# Altium project LPCB218__RLOOP__COMMAND_NODE.PrjPCB (part 1 of 2)
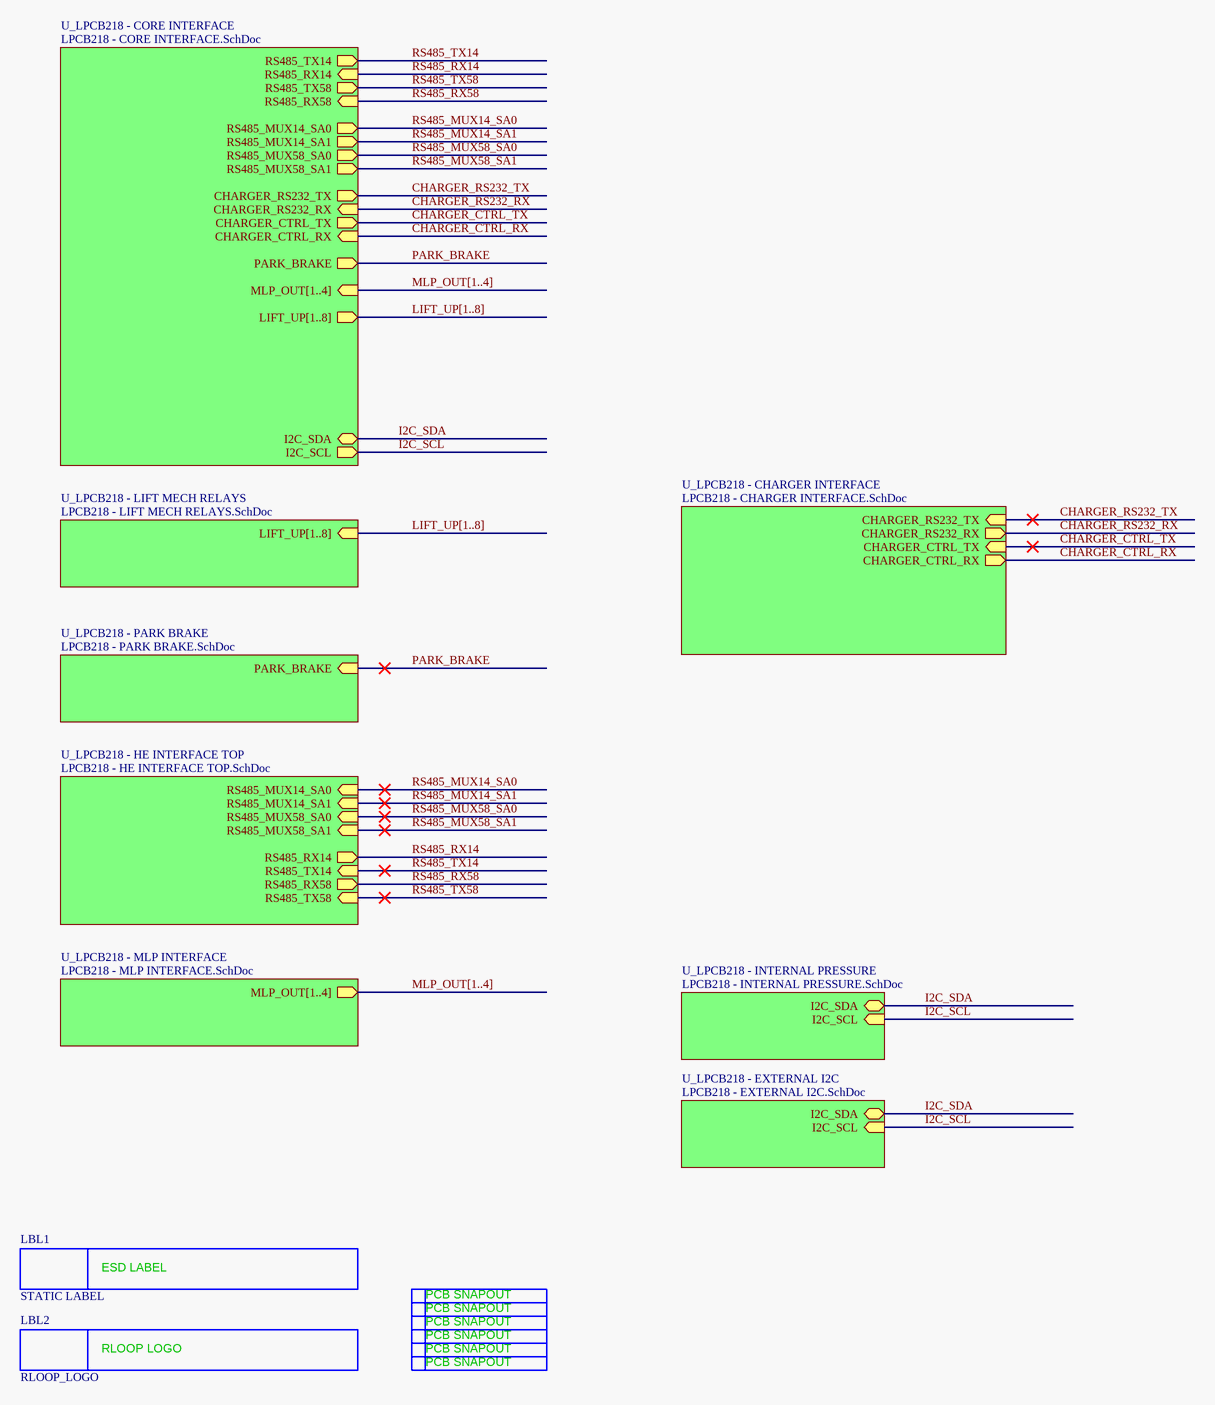
[diagram p0: LPCB218 - OVERVIEW.SchDoc]
14 sheets, 185 parts. Net scope: hierarchical (ports join the sheet entries above them; power ports are global).
Board files: LPCB218R0.PcbDoc, LPCB218R0__ASCII.PcbDoc
Sheets:
  LPCB218 - OVERVIEW.SchDoc
    U_LPCB218 - CHARGER INTERFACE = LPCB218 - CHARGER INTERFACE.SchDoc
    U_LPCB218 - LIFT MECH RELAYS = LPCB218 - LIFT MECH RELAYS.SchDoc
      L1 = LPCB218 - LIFT MECH RELAY.SchDoc
      L2 = LPCB218 - LIFT MECH RELAY.SchDoc
      L3 = LPCB218 - LIFT MECH RELAY.SchDoc
      L4 = LPCB218 - LIFT MECH RELAY.SchDoc
      L5 = LPCB218 - LIFT MECH RELAY.SchDoc
      L6 = LPCB218 - LIFT MECH RELAY.SchDoc
      L7 = LPCB218 - LIFT MECH RELAY.SchDoc
      L8 = LPCB218 - LIFT MECH RELAY.SchDoc
    U_LPCB218 - HE INTERFACE TOP = LPCB218 - HE INTERFACE TOP.SchDoc
      U_LPCB218 - RS485 MUX CONTROL = LPCB218 - RS485 MUX CONTROL.SchDoc
      U_LPCB218 - HEC1-4 = LPCB218 - HEC1-4.SchDoc
      U_LPCB218 - HEC5-8 = LPCB218 - HEC5-8.SchDoc
    U_LPCB218 - PARK BRAKE = LPCB218 - PARK BRAKE.SchDoc
    U_LPCB218 - MLP INTERFACE = LPCB218 - MLP INTERFACE.SchDoc
      M1 = LPCB218 - MLP CHANNEL.SchDoc
      M2 = LPCB218 - MLP CHANNEL.SchDoc
      M3 = LPCB218 - MLP CHANNEL.SchDoc
      M4 = LPCB218 - MLP CHANNEL.SchDoc
    U_LPCB218 - CORE INTERFACE = LPCB218 - CORE INTERFACE.SchDoc
    U_LPCB218 - INTERNAL PRESSURE = LPCB218 - INTERNAL PRESSURE.SchDoc
    U_LPCB218 - EXTERNAL I2C = LPCB218 - EXTERNAL I2C.SchDoc

## Sheet LPCB218 - OVERVIEW.SchDoc
size A3; Address1: Factory 10; Address2: 9-13 Dingley Avenue, Dandeong, VICTORIA 3175, AUSTRALIA; DocumentNumber: 1; Revision: 1; SheetNumber: 1; SheetTotal: 14; Lockie__PCB_SUB_ASSEMBLY: Top Overview; Lockie__PCB_ASSEMBLY: Command Node; Lockie__LDL: LPCB218; Lockie__PCB_DESCRIPTION: Command Node

### Parts
LBL1  STATIC LABEL  [STATIC_LABEL]  (no BOM)
LBL2  RLOOP_LOGO  [RLOOP_LOGO]  (no BOM)
SN1  PCB_SNAPOUT  [SNAPOUT_NEW]  (value not drawn)  (no BOM)
SN2  PCB_SNAPOUT  [SNAPOUT_NEW]  (value not drawn)  (no BOM)
SN3  PCB_SNAPOUT  [SNAPOUT_NEW]  (value not drawn)  (no BOM)
SN4  PCB_SNAPOUT  [SNAPOUT_NEW]  (value not drawn)  (no BOM)
SN5  PCB_SNAPOUT  [SNAPOUT_NEW]  (value not drawn)  (no BOM)
SN6  PCB_SNAPOUT  [SNAPOUT_NEW]  (value not drawn)  (no BOM)

### Sub-sheets
U_LPCB218 - CHARGER INTERFACE = LPCB218 - CHARGER INTERFACE.SchDoc: CHARGER_RS232_TX (in), CHARGER_CTRL_TX (in), CHARGER_RS232_RX (out), CHARGER_CTRL_RX (out)
U_LPCB218 - CORE INTERFACE = LPCB218 - CORE INTERFACE.SchDoc: RS485_RX14 (in), RS485_TX14 (out), PARK_BRAKE (out), CHARGER_RS232_RX (in), CHARGER_RS232_TX (out), RS485_RX58 (in), RS485_MUX14_SA0 (out), RS485_MUX14_SA1 (out), RS485_MUX58_SA0 (out), RS485_MUX58_SA1 (out), CHARGER_CTRL_TX (out), CHARGER_CTRL_RX (in), MLP_OUT[1..4] (in), LIFT_UP[1..8] (out), RS485_TX58 (out), I2C_SDA (bidir), I2C_SCL (out)
U_LPCB218 - EXTERNAL I2C = LPCB218 - EXTERNAL I2C.SchDoc: I2C_SCL (in), I2C_SDA (bidir)
U_LPCB218 - HE INTERFACE TOP = LPCB218 - HE INTERFACE TOP.SchDoc: RS485_MUX14_SA0 (in), RS485_MUX14_SA1 (in), RS485_MUX58_SA0 (in), RS485_MUX58_SA1 (in), RS485_RX14 (out), RS485_TX14 (in), RS485_RX58 (out), RS485_TX58 (in)
U_LPCB218 - INTERNAL PRESSURE = LPCB218 - INTERNAL PRESSURE.SchDoc: I2C_SDA (bidir), I2C_SCL (in)
U_LPCB218 - LIFT MECH RELAYS = LPCB218 - LIFT MECH RELAYS.SchDoc: LIFT_UP[1..8] (in)
U_LPCB218 - MLP INTERFACE = LPCB218 - MLP INTERFACE.SchDoc: MLP_OUT[1..4] (out)
U_LPCB218 - PARK BRAKE = LPCB218 - PARK BRAKE.SchDoc: PARK_BRAKE (in)

### Nets
CHARGER_CTRL_RX: sheet U_LPCB218 - CHARGER INTERFACE/CHARGER_CTRL_RX, sheet U_LPCB218 - CORE INTERFACE/CHARGER_CTRL_RX
CHARGER_CTRL_TX: sheet U_LPCB218 - CHARGER INTERFACE/CHARGER_CTRL_TX, sheet U_LPCB218 - CORE INTERFACE/CHARGER_CTRL_TX
CHARGER_RS232_RX: sheet U_LPCB218 - CHARGER INTERFACE/CHARGER_RS232_RX, sheet U_LPCB218 - CORE INTERFACE/CHARGER_RS232_RX
CHARGER_RS232_TX: sheet U_LPCB218 - CHARGER INTERFACE/CHARGER_RS232_TX, sheet U_LPCB218 - CORE INTERFACE/CHARGER_RS232_TX
I2C_SCL: sheet U_LPCB218 - CORE INTERFACE/I2C_SCL, sheet U_LPCB218 - INTERNAL PRESSURE/I2C_SCL, sheet U_LPCB218 - EXTERNAL I2C/I2C_SCL
I2C_SDA: sheet U_LPCB218 - CORE INTERFACE/I2C_SDA, sheet U_LPCB218 - INTERNAL PRESSURE/I2C_SDA, sheet U_LPCB218 - EXTERNAL I2C/I2C_SDA
PARK_BRAKE: sheet U_LPCB218 - PARK BRAKE/PARK_BRAKE, sheet U_LPCB218 - CORE INTERFACE/PARK_BRAKE
RS485_MUX14_SA0: sheet U_LPCB218 - HE INTERFACE TOP/RS485_MUX14_SA0, sheet U_LPCB218 - CORE INTERFACE/RS485_MUX14_SA0
RS485_MUX14_SA1: sheet U_LPCB218 - HE INTERFACE TOP/RS485_MUX14_SA1, sheet U_LPCB218 - CORE INTERFACE/RS485_MUX14_SA1
RS485_MUX58_SA0: sheet U_LPCB218 - HE INTERFACE TOP/RS485_MUX58_SA0, sheet U_LPCB218 - CORE INTERFACE/RS485_MUX58_SA0
RS485_MUX58_SA1: sheet U_LPCB218 - HE INTERFACE TOP/RS485_MUX58_SA1, sheet U_LPCB218 - CORE INTERFACE/RS485_MUX58_SA1
RS485_RX14: sheet U_LPCB218 - HE INTERFACE TOP/RS485_RX14, sheet U_LPCB218 - CORE INTERFACE/RS485_RX14
RS485_RX58: sheet U_LPCB218 - HE INTERFACE TOP/RS485_RX58, sheet U_LPCB218 - CORE INTERFACE/RS485_RX58
RS485_TX14: sheet U_LPCB218 - HE INTERFACE TOP/RS485_TX14, sheet U_LPCB218 - CORE INTERFACE/RS485_TX14
RS485_TX58: sheet U_LPCB218 - HE INTERFACE TOP/RS485_TX58, sheet U_LPCB218 - CORE INTERFACE/RS485_TX58

### Buses and harness runs
bus LIFT_UP[1..8] = sheet U_LPCB218 - CORE INTERFACE/LIFT_UP[1..8]
bus LIFT_UP[1..8] = sheet U_LPCB218 - LIFT MECH RELAYS/LIFT_UP[1..8]
bus MLP_OUT[1..4] = sheet U_LPCB218 - CORE INTERFACE/MLP_OUT[1..4]
bus MLP_OUT[1..4] = sheet U_LPCB218 - MLP INTERFACE/MLP_OUT[1..4]

### Notes on the sheet
- PCB COMPONENT DESCRIPTION
- LDL NUMBER
- Assembly Details
- Size
- Drawing File Name
- Revision
- http://rloop.org
- Scale
- A3
- Sheet Details
- N.T.S
- Sheet:
- Of:
- (in symbol PCB_SNAPOUT) PCB SNAPOUT
- (in symbol RLOOP_LOGO) RLOOP LOGO
- (in symbol STATIC LABEL) ESD LABEL

### Library data of the parts
LBL1 = STATIC LABEL: FMEDA__CHANNEL: DIAG; FMEDA__FUNCTION_IN_SYSTEM: *
LBL2 = RLOOP_LOGO: FMEDA__CHANNEL: DIAG; FMEDA__FUNCTION_IN_SYSTEM: *
SN1-SN6 = PCB_SNAPOUT: FMEDA__CHANNEL: DIAG; FMEDA__FUNCTION_IN_SYSTEM: *

## Sheet LPCB218 - CHARGER INTERFACE.SchDoc
size A3; Address1: Factory 10; Address2: 9-13 Dingley Avenue, Dandeong, VICTORIA 3175, AUSTRALIA; DocumentNumber: 2; Revision: 1; SheetNumber: 2; SheetTotal: 14; Lockie__PCB_SUB_ASSEMBLY: Charger IF; Lockie__PCB_ASSEMBLY: Command Node; Lockie__LDL: LPCB218; Lockie__PCB_DESCRIPTION: Command Node
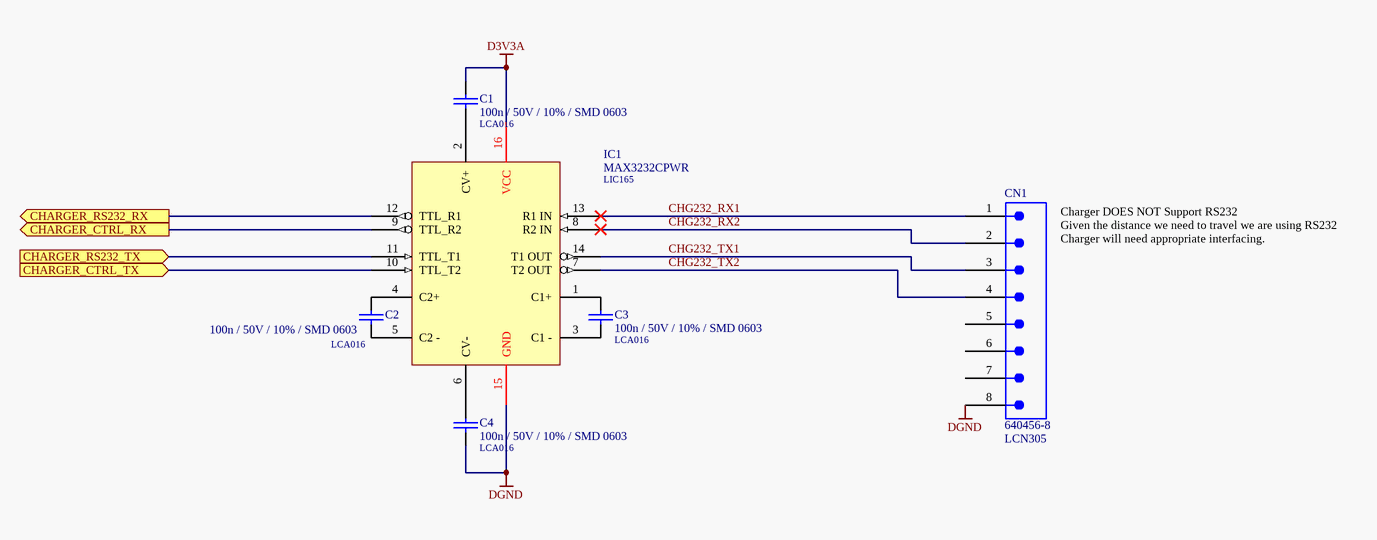
[diagram p1: LPCB218 - CHARGER INTERFACE.SchDoc]

### Parts
C1  100n / 50V / 10% / SMD 0603  LDL_NUMBER: LCA016  [LFP011__CC1608-0603-IPC7351_B]
C2  100n / 50V / 10% / SMD 0603  LDL_NUMBER: LCA016  [LFP011__CC1608-0603-IPC7351_B]
C3  100n / 50V / 10% / SMD 0603  LDL_NUMBER: LCA016  [LFP011__CC1608-0603-IPC7351_B]
C4  100n / 50V / 10% / SMD 0603  LDL_NUMBER: LCA016  [LFP011__CC1608-0603-IPC7351_B]
CN1  640456-8  LDL_NUMBER: LCN305  [640456-8]
IC1  MAX3232CPWR  LDL_NUMBER: LIC165  [LFP049__TSSOP-16]

### Ports
CHARGER_CTRL_RX (out), CHARGER_CTRL_TX (in), CHARGER_RS232_RX (out), CHARGER_RS232_TX (in)

### Nets
D3V3A: C1.1 IC1.16(VCC)
DGND: C4.2 CN1.8 IC1.15(GND)
CHARGER_CTRL_RX: IC1.9(TTL_R2) ; port CHARGER_CTRL_RX
CHARGER_CTRL_TX: IC1.10(TTL_T2) ; port CHARGER_CTRL_TX
CHARGER_RS232_RX: IC1.12(TTL_R1) ; port CHARGER_RS232_RX
CHARGER_RS232_TX: IC1.11(TTL_T1) ; port CHARGER_RS232_TX
CHG232_RX1: CN1.1 IC1.13(R1_IN)
CHG232_RX2: CN1.2 IC1.8(R2_IN)
CHG232_TX1: CN1.3 IC1.14(T1_OUT)
CHG232_TX2: CN1.4 IC1.7(T2_OUT)
NetC1_2: C1.2 IC1.2(CV+)
NetC2_1: C2.1 IC1.4(C2+)
NetC2_2: C2.2 IC1.5(C2_-)
NetC3_1: C3.1 IC1.1(C1+)
NetC3_2: C3.2 IC1.3(C1_-)
NetC4_1: C4.1 IC1.6(CV-)

Not connected (* = marked no-connect by the designer): CN1 5 6 7

### Notes on the sheet
- Charger DOES NOT Support RS232
  Given the distance we need to travel we are using RS232
  Charger will need appropriate interfacing.
- PCB COMPONENT DESCRIPTION
- LDL NUMBER
- Assembly Details
- Size
- Drawing File Name
- Revision
- http://rloop.org
- Scale
- A3
- Sheet Details
- N.T.S
- Sheet:
- Of:

### Library data of the parts
C1-C4 = 100n / 50V / 10% / SMD 0603: Capacitor, Ceramic Chip, 100nF, 50V, 10%, SMD 0603; FMEDA__OPERATING__VOLTAGE_MIN: 0; FMEDA__OPERATING__VOLTAGE_MAX: 3.3; FMEDA__OPERATING__TEMP_MIN: -20; FMEDA__OPERATING__TEMP_TYP: 27; FMEDA__OPERATING__TEMP_MAX: 50; FMEDA__CHANNEL: COM; Value: 100n; FMEDA__FUNCTION_IN_SYSTEM: *; FMEDA__OPERATING__VOLTAGE_TYP: 3.3
CN1 = 640456-8: Connector, Male Header, 8 Way; FMEDA__CHANNEL: COM; FMEDA__OPERATING__CURRENT_MAX: 0; FMEDA__OPERATING__TEMP_MAX: 50; FMEDA__OPERATING__TEMP_MIN: -20; FMEDA__OPERATING__TEMP_TYP: 27; FMEDA__OPERATING__VOLTAGE_MAX: 16; FMEDA__OPERATING__VOLTAGE_TYP: 12; FMEDA__FUNCTION_IN_SYSTEM: *; FMEDA__OPERATING__CURRENT_MIN: 0; FMEDA__OPERATING__CURRENT_TYP: 0; FMEDA__OPERATING__VOLTAGE_MIN: 0
IC1 = MAX3232CPWR: IC, RS232 Line Driver, 3.3V, SMD TSSOP16; FMEDA__OPERATING__TEMP_MAX: 50; FMEDA__OPERATING__TEMP_MIN: -20; FMEDA__OPERATING__TEMP_TYP: 27; FMEDA__CHANNEL: COM; FMEDA__OPERATING__VOLTAGE_MAX: 3.3; FMEDA__OPERATING__VOLTAGE_MIN: 0; FMEDA__FUNCTION_IN_SYSTEM: *; FMEDA__OPERATING__VOLTAGE_TYP: 3.3

## Sheet LPCB218 - LIFT MECH RELAYS.SchDoc
size A3; Address1: Factory 10; Address2: 9-13 Dingley Avenue, Dandeong, VICTORIA 3175, AUSTRALIA; DocumentNumber: 10; Revision: 1; SheetNumber: 10; SheetTotal: 14; Lockie__PCB_SUB_ASSEMBLY: Lift Mech; Lockie__PCB_ASSEMBLY: Command Node; Lockie__LDL: LPCB218; Lockie__PCB_DESCRIPTION: Command Node
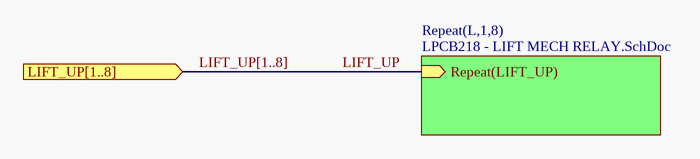
[diagram p2: LPCB218 - LIFT MECH RELAYS.SchDoc]

### Sub-sheets
Repeat(L,1,8) = LPCB218 - LIFT MECH RELAY.SchDoc: Repeat(LIFT_UP) (in)

### Ports
LIFT_UP[1..8] (in)

### Nets
LIFT_UP: sheet Repeat(L,1,8)/Repeat(LIFT_UP)

### Buses and harness runs
bus LIFT_UP[1..8] = port LIFT_UP[1..8]

### Notes on the sheet
- PCB COMPONENT DESCRIPTION
- LDL NUMBER
- Assembly Details
- Size
- Drawing File Name
- Revision
- http://rloop.org
- Scale
- A3
- Sheet Details
- N.T.S
- Sheet:
- Of:

## Sheet LPCB218 - LIFT MECH RELAY.SchDoc
size A3; Address1: Factory 10; Address2: 9-13 Dingley Avenue, Dandeong, VICTORIA 3175, AUSTRALIA; DocumentNumber: 11; Revision: 1; SheetNumber: 11; SheetTotal: 14; Lockie__PCB_SUB_ASSEMBLY: Lift Mech; Lockie__PCB_ASSEMBLY: Command Node; Lockie__LDL: LPCB218; Lockie__PCB_DESCRIPTION: Command Node
Used 8 times, as channels U_LPCB218 - LIFT MECH RELAYS/L1, U_LPCB218 - LIFT MECH RELAYS/L2, U_LPCB218 - LIFT MECH RELAYS/L3, U_LPCB218 - LIFT MECH RELAYS/L4, U_LPCB218 - LIFT MECH RELAYS/L5, U_LPCB218 - LIFT MECH RELAYS/L6, U_LPCB218 - LIFT MECH RELAYS/L7, U_LPCB218 - LIFT MECH RELAYS/L8. Parts and nets are listed once, with the designators drawn on the sheet.
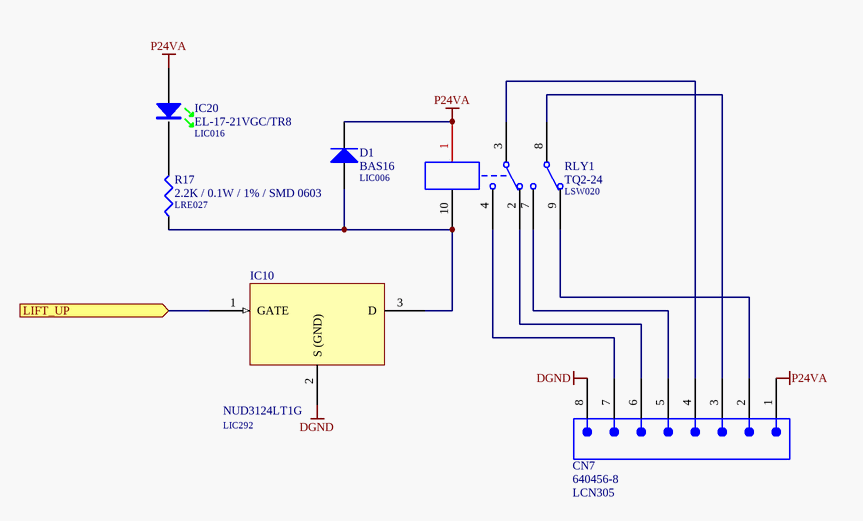
[diagram p3: LPCB218 - LIFT MECH RELAY.SchDoc]

### Parts
CN7  640456-8  LDL_NUMBER: LCN305  [640456-8]
D1  BAS16  LDL_NUMBER: LIC006  [LFP021__SOT23]
IC10  NUD3124LT1G  LDL_NUMBER: LIC292  [LFP021__SOT23]
IC20  EL-17-21VGC/TR8  LDL_NUMBER: LIC016  [CR2012-0805-LED]
R17  2.2K / 0.1W / 1% / SMD 0603  LDL_NUMBER: LRE027  [LFP020__CR1608-0603-IPC7351_B]
RLY1  TQ2-24  LDL_NUMBER: LSW020  [TQ2]

### Ports
LIFT_UP (in)

### Nets
DGND: CN7.8 IC10.2(S_(GND))
P24VA: CN7.1 D1.3(K) IC20.A RLY1.1
LIFT_UP: IC10.1(GATE) ; port LIFT_UP
NetCN7_2: CN7.2 RLY1.9
NetCN7_3: CN7.3 RLY1.8
NetCN7_4: CN7.4 RLY1.3
NetCN7_5: CN7.5 RLY1.7
NetCN7_6: CN7.6 RLY1.2
NetCN7_7: CN7.7 RLY1.4
NetD1_1: D1.1(A) IC10.3(D) R17.1 RLY1.10
NetIC20_K: IC20.K R17.2

### Channels
U_LPCB218 - LIFT MECH RELAYS/L1: designators end in _L1; ports LIFT_UP=LIFT_UP1
U_LPCB218 - LIFT MECH RELAYS/L2: designators end in _L2; ports LIFT_UP=LIFT_UP2
U_LPCB218 - LIFT MECH RELAYS/L3: designators end in _L3; ports LIFT_UP=LIFT_UP3
U_LPCB218 - LIFT MECH RELAYS/L4: designators end in _L4; ports LIFT_UP=LIFT_UP4
U_LPCB218 - LIFT MECH RELAYS/L5: designators end in _L5; ports LIFT_UP=LIFT_UP5
U_LPCB218 - LIFT MECH RELAYS/L6: designators end in _L6; ports LIFT_UP=LIFT_UP6
U_LPCB218 - LIFT MECH RELAYS/L7: designators end in _L7; ports LIFT_UP=LIFT_UP7
U_LPCB218 - LIFT MECH RELAYS/L8: designators end in _L8; ports LIFT_UP=LIFT_UP8

### Notes on the sheet
- PCB COMPONENT DESCRIPTION
- LDL NUMBER
- Assembly Details
- Size
- Drawing File Name
- Revision
- http://rloop.org
- Scale
- A3
- Sheet Details
- N.T.S
- Sheet:
- Of:

### Library data of the parts
CN7 = 640456-8: as CN1 on sheet LPCB218 - CHARGER INTERFACE; FMEDA__FUNCTION_IN_SYSTEM: *; FMEDA__OPERATING__CURRENT_MIN: 0; FMEDA__OPERATING__CURRENT_TYP: 0; FMEDA__OPERATING__VOLTAGE_MIN: 0
D1 = BAS16: Diode, Small Signal, 0.2A, 85V, SMD SOT-23 [LIC006]; FMEDA__OPERATING__CURRENT_MIN: 0; FMEDA__OPERATING__TEMP_MIN: -20; FMEDA__OPERATING__TEMP_TYP: 27; FMEDA__OPERATING__TEMP_MAX: 50; FMEDA__CHANNEL: COM; FMEDA__OPERATING__CURRENT_MAX: 0; FMEDA__OPERATING__VOLTAGE_MIN: 0; FMEDA__OPERATING__VOLTAGE_MAX: 0; FMEDA__FUNCTION_IN_SYSTEM: *; FMEDA__OPERATING__CURRENT_TYP: 0; FMEDA__OPERATING__VOLTAGE_TYP: 0
IC10 = NUD3124LT1G: IC, Relay Driver, 28V Industrial, SMD SOT23 [LIC292]; FMEDA__OPERATING__TEMP_MIN: -20; FMEDA__OPERATING__TEMP_TYP: 27; FMEDA__OPERATING__TEMP_MAX: 50; FMEDA__OPERATING__VOLTAGE_MIN: 0; FMEDA__OPERATING__VOLTAGE_TYP: 13; FMEDA__OPERATING__VOLTAGE_MAX: 18; FMEDA__OPERATING__POWER_TYP: 0.1; FMEDA__OPERATING__POWER_MAX: 0.15; FMEDA__CHANNEL: COM; FMEDA__FUNCTION_IN_SYSTEM: *; FMEDA__OPERATING__POWER_MIN: 0
IC20 = EL-17-21VGC/TR8: LED, SMD, 0805 Green [LIC016]; FMEDA__OPERATING__TEMP_MAX: 50; FMEDA__OPERATING__TEMP_MIN: -20; FMEDA__OPERATING__TEMP_TYP: 27; FMEDA__CHANNEL: COM; FMEDA__FUNCTION_IN_SYSTEM: *
R17 = 2.2K / 0.1W / 1% / SMD 0603: Resistor, Ceramic Chip, 2.2K, 0.1W, 1%, SMD 0603 [LRE027]; FMEDA__OPERATING__VOLTAGE_MIN: 0; FMEDA__OPERATING__TEMP_MIN: -20; FMEDA__OPERATING__TEMP_TYP: 27; FMEDA__OPERATING__TEMP_MAX: 50; FMEDA__CHANNEL: COM; VALUE: 2.2K; FMEDA__OPERATING__VOLTAGE_MAX: 0; FMEDA__OPERATING__POWER_MIN: 0; FMEDA__OPERATING__POWER_MAX: 0; FMEDA__FUNCTION_IN_SYSTEM: *; FMEDA__OPERATING__VOLTAGE_TYP: 0
RLY1 = TQ2-24: Relay, DPDT, Non Latching, 24VDC Coil, 1A Rating, PTH; FMEDA__CHANNEL: COM; FMEDA__OPERATING__TEMP_MAX: 50; FMEDA__OPERATING__TEMP_MIN: -20; FMEDA__OPERATING__TEMP_TYP: 27; Revision: July-2002: Re-released for DXP Platform.

## Sheet LPCB218 - HE INTERFACE TOP.SchDoc
size A3; Address1: Factory 10; Address2: 9-13 Dingley Avenue, Dandeong, VICTORIA 3175, AUSTRALIA; DocumentNumber: 5; Revision: 1; SheetNumber: 5; SheetTotal: 14; Lockie__PCB_SUB_ASSEMBLY: HE Interface; Lockie__PCB_ASSEMBLY: Command Node; Lockie__LDL: LPCB218; Lockie__PCB_DESCRIPTION: Command Node
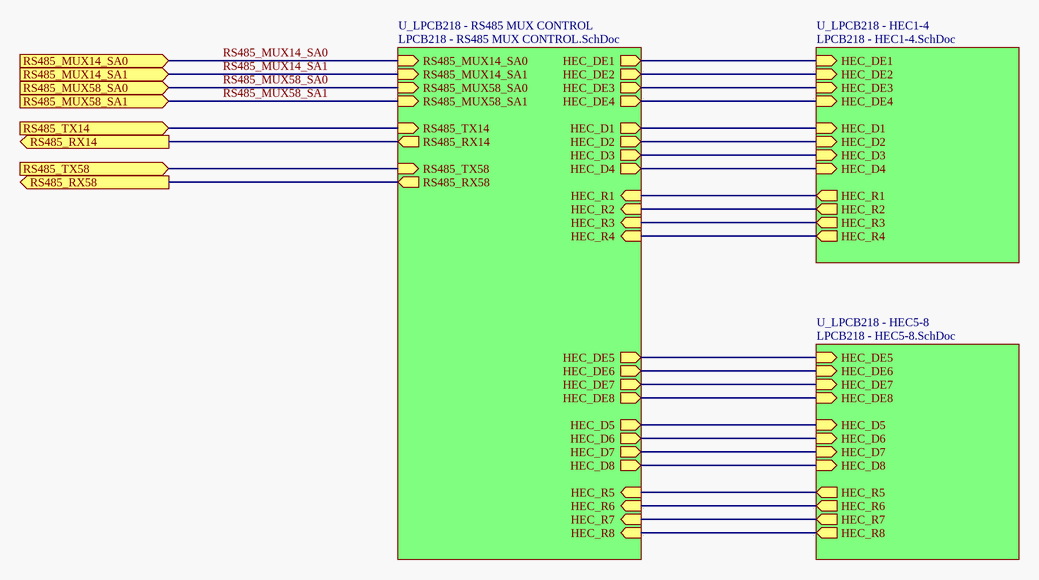
[diagram p4: LPCB218 - HE INTERFACE TOP.SchDoc]

### Sub-sheets
U_LPCB218 - HEC1-4 = LPCB218 - HEC1-4.SchDoc: HEC_R1 (out), HEC_D1 (in), HEC_DE1 (in), HEC_R2 (out), HEC_D2 (in), HEC_DE2 (in), HEC_R3 (out), HEC_D3 (in), HEC_DE3 (in), HEC_R4 (out), HEC_D4 (in), HEC_DE4 (in)
U_LPCB218 - HEC5-8 = LPCB218 - HEC5-8.SchDoc: HEC_R5 (out), HEC_D5 (in), HEC_DE5 (in), HEC_R6 (out), HEC_D6 (in), HEC_DE6 (in), HEC_R7 (out), HEC_D7 (in), HEC_DE7 (in), HEC_R8 (out), HEC_D8 (in), HEC_DE8 (in)
U_LPCB218 - RS485 MUX CONTROL = LPCB218 - RS485 MUX CONTROL.SchDoc: RS485_MUX14_SA0 (in), RS485_MUX14_SA1 (in), RS485_MUX58_SA0 (in), RS485_MUX58_SA1 (in), HEC_DE1 (out), HEC_DE2 (out), HEC_DE3 (out), HEC_DE4 (out), HEC_DE5 (out), HEC_DE6 (out), HEC_DE7 (out), HEC_DE8 (out), RS485_RX14 (out), RS485_TX14 (in), HEC_R1 (in), HEC_R2 (in), HEC_R3 (in), HEC_R4 (in), HEC_D1 (out), HEC_D2 (out), HEC_D3 (out), HEC_D4 (out), RS485_RX58 (out), RS485_TX58 (in), HEC_R5 (in), HEC_D5 (out), HEC_R6 (in), HEC_R7 (in), HEC_R8 (in), HEC_D6 (out), HEC_D7 (out), HEC_D8 (out)

### Ports
RS485_MUX14_SA0 (in), RS485_MUX14_SA1 (in), RS485_MUX58_SA0 (in), RS485_MUX58_SA1 (in), RS485_RX14 (out), RS485_RX58 (out), RS485_TX14 (in), RS485_TX58 (in)

### Nets
HEC_D1: sheet U_LPCB218 - RS485 MUX CONTROL/HEC_D1, sheet U_LPCB218 - HEC1-4/HEC_D1
HEC_D2: sheet U_LPCB218 - RS485 MUX CONTROL/HEC_D2, sheet U_LPCB218 - HEC1-4/HEC_D2
HEC_D3: sheet U_LPCB218 - RS485 MUX CONTROL/HEC_D3, sheet U_LPCB218 - HEC1-4/HEC_D3
HEC_D4: sheet U_LPCB218 - RS485 MUX CONTROL/HEC_D4, sheet U_LPCB218 - HEC1-4/HEC_D4
HEC_D5: sheet U_LPCB218 - RS485 MUX CONTROL/HEC_D5, sheet U_LPCB218 - HEC5-8/HEC_D5
HEC_D6: sheet U_LPCB218 - RS485 MUX CONTROL/HEC_D6, sheet U_LPCB218 - HEC5-8/HEC_D6
HEC_D7: sheet U_LPCB218 - RS485 MUX CONTROL/HEC_D7, sheet U_LPCB218 - HEC5-8/HEC_D7
HEC_D8: sheet U_LPCB218 - RS485 MUX CONTROL/HEC_D8, sheet U_LPCB218 - HEC5-8/HEC_D8
HEC_DE1: sheet U_LPCB218 - RS485 MUX CONTROL/HEC_DE1, sheet U_LPCB218 - HEC1-4/HEC_DE1
HEC_DE2: sheet U_LPCB218 - RS485 MUX CONTROL/HEC_DE2, sheet U_LPCB218 - HEC1-4/HEC_DE2
HEC_DE3: sheet U_LPCB218 - RS485 MUX CONTROL/HEC_DE3, sheet U_LPCB218 - HEC1-4/HEC_DE3
HEC_DE4: sheet U_LPCB218 - RS485 MUX CONTROL/HEC_DE4, sheet U_LPCB218 - HEC1-4/HEC_DE4
HEC_DE5: sheet U_LPCB218 - RS485 MUX CONTROL/HEC_DE5, sheet U_LPCB218 - HEC5-8/HEC_DE5
HEC_DE6: sheet U_LPCB218 - RS485 MUX CONTROL/HEC_DE6, sheet U_LPCB218 - HEC5-8/HEC_DE6
HEC_DE7: sheet U_LPCB218 - RS485 MUX CONTROL/HEC_DE7, sheet U_LPCB218 - HEC5-8/HEC_DE7
HEC_DE8: sheet U_LPCB218 - RS485 MUX CONTROL/HEC_DE8, sheet U_LPCB218 - HEC5-8/HEC_DE8
HEC_R1: sheet U_LPCB218 - RS485 MUX CONTROL/HEC_R1, sheet U_LPCB218 - HEC1-4/HEC_R1
HEC_R2: sheet U_LPCB218 - RS485 MUX CONTROL/HEC_R2, sheet U_LPCB218 - HEC1-4/HEC_R2
HEC_R3: sheet U_LPCB218 - RS485 MUX CONTROL/HEC_R3, sheet U_LPCB218 - HEC1-4/HEC_R3
HEC_R4: sheet U_LPCB218 - RS485 MUX CONTROL/HEC_R4, sheet U_LPCB218 - HEC1-4/HEC_R4
HEC_R5: sheet U_LPCB218 - RS485 MUX CONTROL/HEC_R5, sheet U_LPCB218 - HEC5-8/HEC_R5
HEC_R6: sheet U_LPCB218 - RS485 MUX CONTROL/HEC_R6, sheet U_LPCB218 - HEC5-8/HEC_R6
HEC_R7: sheet U_LPCB218 - RS485 MUX CONTROL/HEC_R7, sheet U_LPCB218 - HEC5-8/HEC_R7
HEC_R8: sheet U_LPCB218 - RS485 MUX CONTROL/HEC_R8, sheet U_LPCB218 - HEC5-8/HEC_R8
RS485_MUX14_SA0: port RS485_MUX14_SA0, sheet U_LPCB218 - RS485 MUX CONTROL/RS485_MUX14_SA0
RS485_MUX14_SA1: port RS485_MUX14_SA1, sheet U_LPCB218 - RS485 MUX CONTROL/RS485_MUX14_SA1
RS485_MUX58_SA0: port RS485_MUX58_SA0, sheet U_LPCB218 - RS485 MUX CONTROL/RS485_MUX58_SA0
RS485_MUX58_SA1: port RS485_MUX58_SA1, sheet U_LPCB218 - RS485 MUX CONTROL/RS485_MUX58_SA1
RS485_RX14: port RS485_RX14, sheet U_LPCB218 - RS485 MUX CONTROL/RS485_RX14
RS485_RX58: port RS485_RX58, sheet U_LPCB218 - RS485 MUX CONTROL/RS485_RX58
RS485_TX14: port RS485_TX14, sheet U_LPCB218 - RS485 MUX CONTROL/RS485_TX14
RS485_TX58: port RS485_TX58, sheet U_LPCB218 - RS485 MUX CONTROL/RS485_TX58

### Notes on the sheet
- PCB COMPONENT DESCRIPTION
- LDL NUMBER
- Assembly Details
- Size
- Drawing File Name
- Revision
- http://rloop.org
- Scale
- A3
- Sheet Details
- N.T.S
- Sheet:
- Of:

## Sheet LPCB218 - RS485 MUX CONTROL.SchDoc
size A3; Address1: Factory 10; Address2: 9-13 Dingley Avenue, Dandeong, VICTORIA 3175, AUSTRALIA; DocumentNumber: 8; Revision: 1; SheetNumber: 8; SheetTotal: 14; Lockie__PCB_SUB_ASSEMBLY: RS485 Mux.; Lockie__PCB_ASSEMBLY: Command Node; Lockie__LDL: LPCB218; Lockie__PCB_DESCRIPTION: Command Node
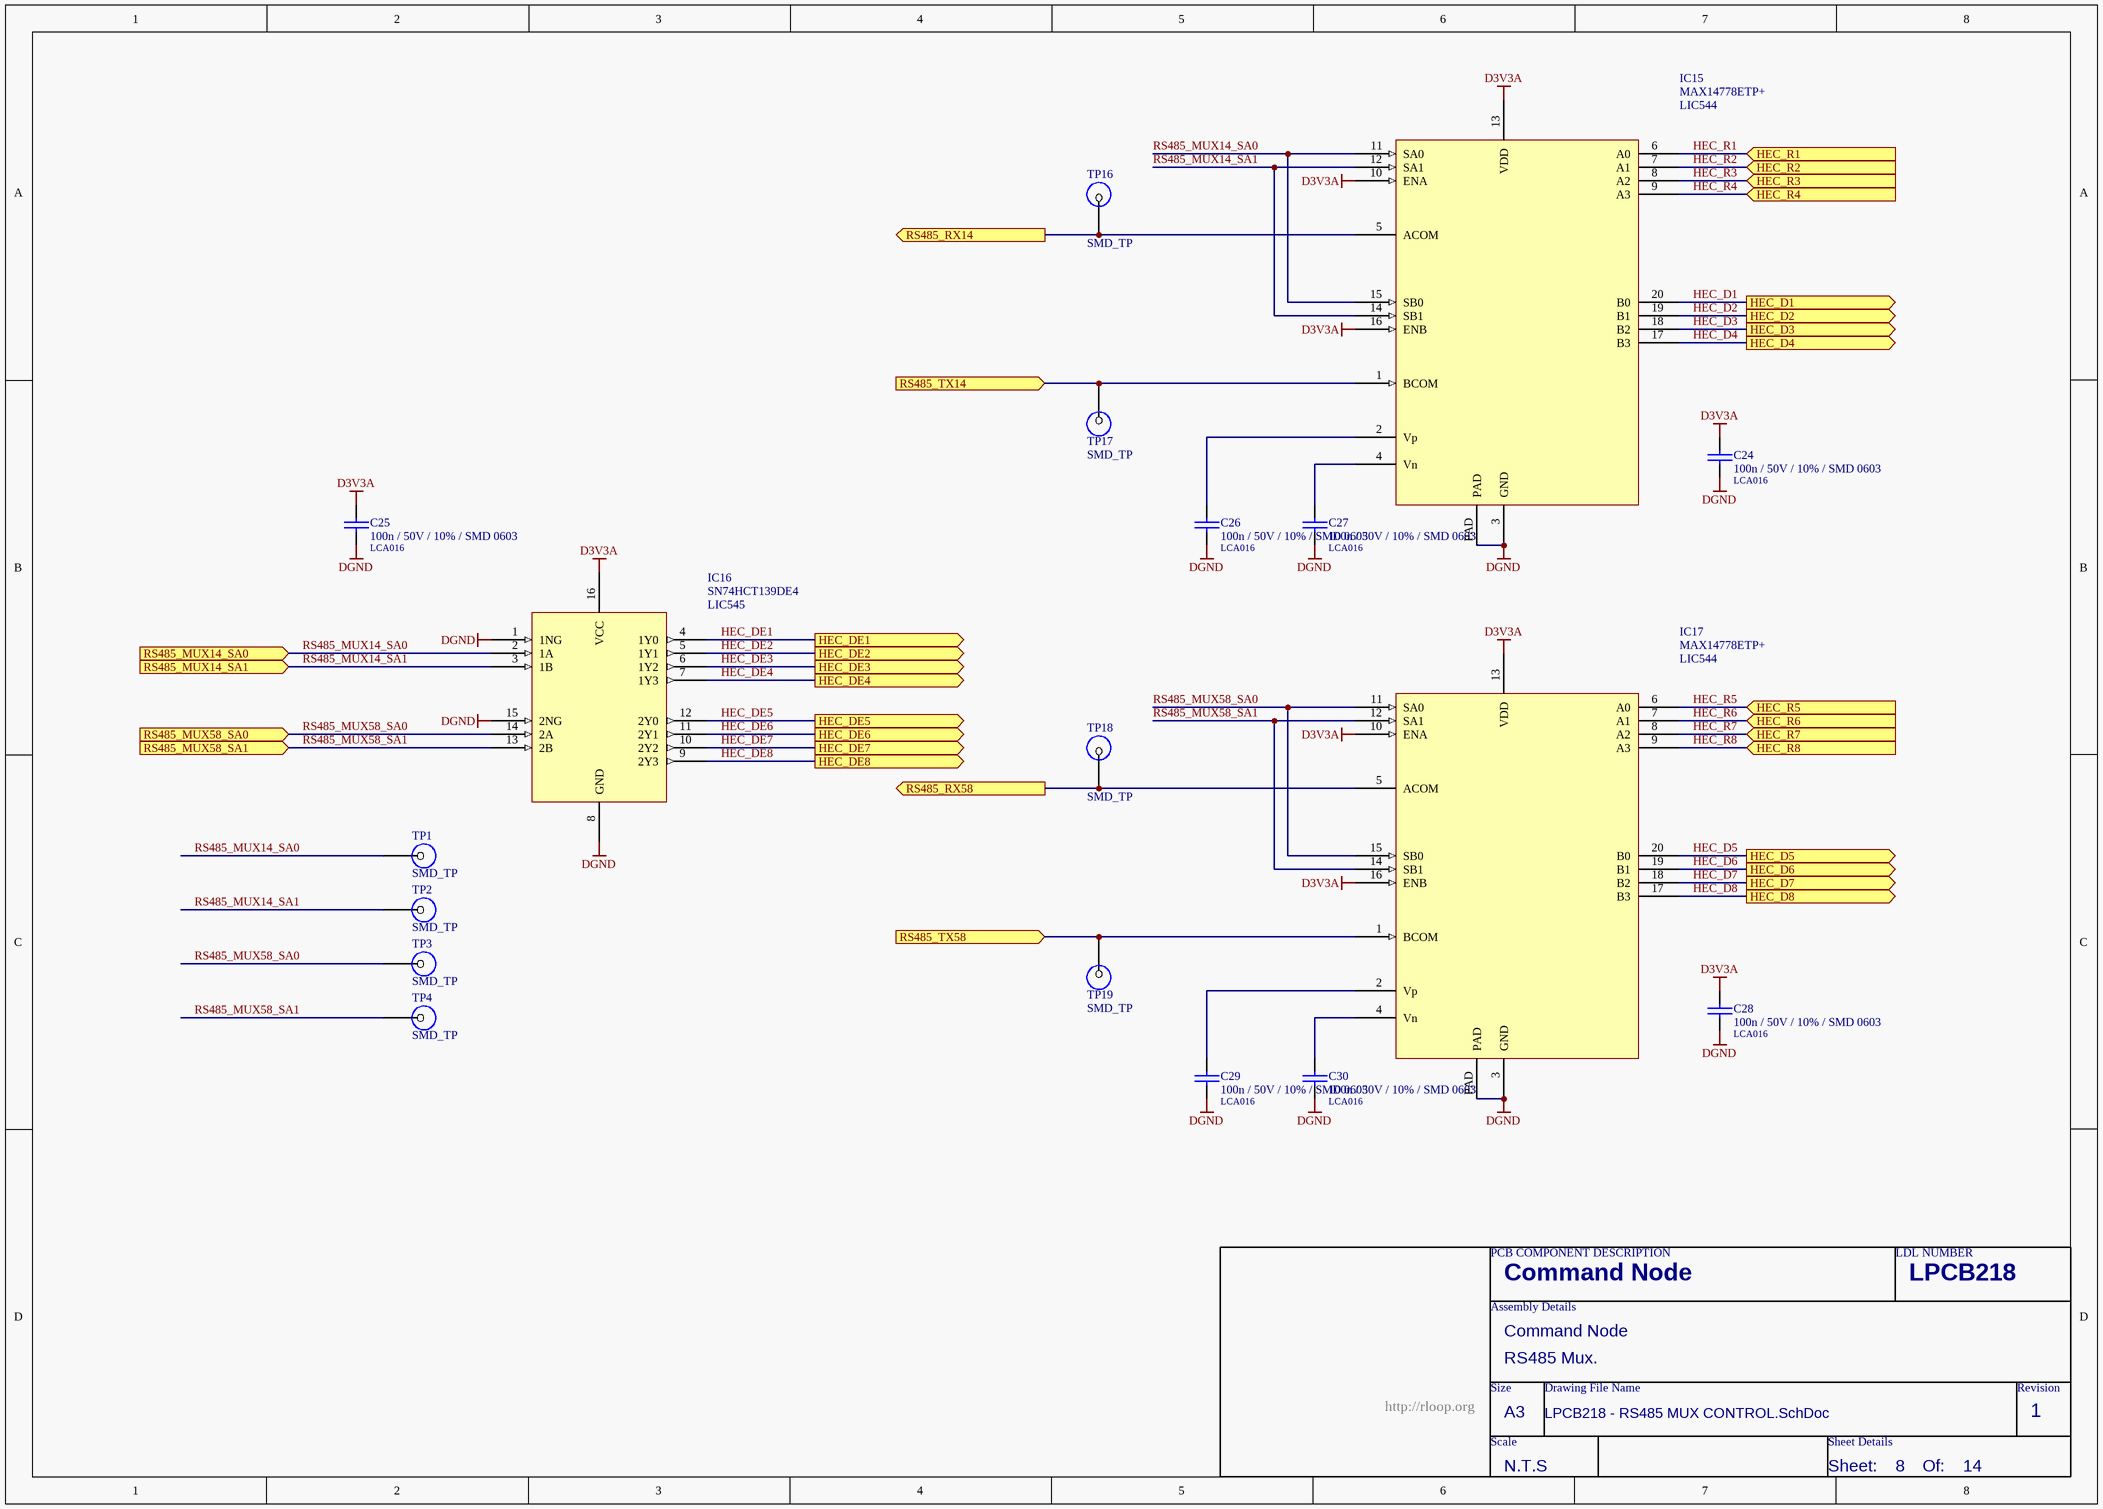
[diagram p5: LPCB218 - RS485 MUX CONTROL.SchDoc]

### Parts
C24  100n / 50V / 10% / SMD 0603  LDL_NUMBER: LCA016  [LFP011__CC1608-0603-IPC7351_B]
C25  100n / 50V / 10% / SMD 0603  LDL_NUMBER: LCA016  [LFP011__CC1608-0603-IPC7351_B]
C26  100n / 50V / 10% / SMD 0603  LDL_NUMBER: LCA016  [LFP011__CC1608-0603-IPC7351_B]
C27  100n / 50V / 10% / SMD 0603  LDL_NUMBER: LCA016  [LFP011__CC1608-0603-IPC7351_B]
C28  100n / 50V / 10% / SMD 0603  LDL_NUMBER: LCA016  [LFP011__CC1608-0603-IPC7351_B]
C29  100n / 50V / 10% / SMD 0603  LDL_NUMBER: LCA016  [LFP011__CC1608-0603-IPC7351_B]
C30  100n / 50V / 10% / SMD 0603  LDL_NUMBER: LCA016  [LFP011__CC1608-0603-IPC7351_B]
IC15  MAX14778ETP+  LDL_NUMBER: LIC544  [LFP014__QFN65P500X500X80_HS-21N]
IC16  SN74HCT139DE4  LDL_NUMBER: LIC545  [LFP079__SOP16]
IC17  MAX14778ETP+  LDL_NUMBER: LIC544  [LFP014__QFN65P500X500X80_HS-21N]
TP1  SMD_TP  [SMD-TP]  (no BOM)
TP2  SMD_TP  [SMD-TP]  (no BOM)
TP3  SMD_TP  [SMD-TP]  (no BOM)
TP4  SMD_TP  [SMD-TP]  (no BOM)
TP16  SMD_TP  [SMD-TP]  (no BOM)
TP17  SMD_TP  [SMD-TP]  (no BOM)
TP18  SMD_TP  [SMD-TP]  (no BOM)
TP19  SMD_TP  [SMD-TP]  (no BOM)

### Ports
HEC_D1 (out), HEC_D2 (out), HEC_D3 (out), HEC_D4 (out), HEC_D5 (out), HEC_D6 (out), HEC_D7 (out), HEC_D8 (out), HEC_DE1 (out), HEC_DE2 (out), HEC_DE3 (out), HEC_DE4 (out), HEC_DE5 (out), HEC_DE6 (out), HEC_DE7 (out), HEC_DE8 (out), HEC_R1 (in), HEC_R2 (in), HEC_R3 (in), HEC_R4 (in), HEC_R5 (in), HEC_R6 (in), HEC_R7 (in), HEC_R8 (in), RS485_MUX14_SA0 (in), RS485_MUX14_SA1 (in), RS485_MUX58_SA0 (in), RS485_MUX58_SA1 (in), RS485_RX14 (out), RS485_RX58 (out), RS485_TX14 (in), RS485_TX58 (in)

### Nets
D3V3A: C24.1 C25.1 C28.1 IC15.10(ENA) IC15.13(VDD) IC15.16(ENB) IC16.16(VCC) IC17.10(ENA) IC17.13(VDD) IC17.16(ENB)
DGND: C24.2 C25.2 C26.2 C27.2 C28.2 C29.2 C30.2 IC15.3(GND) IC15.PAD IC16.1(1NG) IC16.8(GND) IC16.15(2NG) IC17.3(GND) IC17.PAD
HEC_D1: IC15.20(B0) ; port HEC_D1
HEC_D2: IC15.19(B1) ; port HEC_D2
HEC_D3: IC15.18(B2) ; port HEC_D3
HEC_D4: IC15.17(B3) ; port HEC_D4
HEC_D5: IC17.20(B0) ; port HEC_D5
HEC_D6: IC17.19(B1) ; port HEC_D6
HEC_D7: IC17.18(B2) ; port HEC_D7
HEC_D8: IC17.17(B3) ; port HEC_D8
HEC_DE1: IC16.4(1Y0) ; port HEC_DE1
HEC_DE2: IC16.5(1Y1) ; port HEC_DE2
HEC_DE3: IC16.6(1Y2) ; port HEC_DE3
HEC_DE4: IC16.7(1Y3) ; port HEC_DE4
HEC_DE5: IC16.12(2Y0) ; port HEC_DE5
HEC_DE6: IC16.11(2Y1) ; port HEC_DE6
HEC_DE7: IC16.10(2Y2) ; port HEC_DE7
HEC_DE8: IC16.9(2Y3) ; port HEC_DE8
HEC_R1: IC15.6(A0) ; port HEC_R1
HEC_R2: IC15.7(A1) ; port HEC_R2
HEC_R3: IC15.8(A2) ; port HEC_R3
HEC_R4: IC15.9(A3) ; port HEC_R4
HEC_R5: IC17.6(A0) ; port HEC_R5
HEC_R6: IC17.7(A1) ; port HEC_R6
HEC_R7: IC17.8(A2) ; port HEC_R7
HEC_R8: IC17.9(A3) ; port HEC_R8
RS485_MUX14_SA0: IC15.11(SA0) IC15.15(SB0) IC16.2(1A) TP1.1 ; port RS485_MUX14_SA0
RS485_MUX14_SA1: IC15.12(SA1) IC15.14(SB1) IC16.3(1B) TP2.1 ; port RS485_MUX14_SA1
RS485_MUX58_SA0: IC16.14(2A) IC17.11(SA0) IC17.15(SB0) TP3.1 ; port RS485_MUX58_SA0
RS485_MUX58_SA1: IC16.13(2B) IC17.12(SA1) IC17.14(SB1) TP4.1 ; port RS485_MUX58_SA1
RS485_RX14: IC15.5(ACOM) TP16.1 ; port RS485_RX14
RS485_RX58: IC17.5(ACOM) TP18.1 ; port RS485_RX58
RS485_TX14: IC15.1(BCOM) TP17.1 ; port RS485_TX14
RS485_TX58: IC17.1(BCOM) TP19.1 ; port RS485_TX58
NetC26_1: C26.1 IC15.2(Vp)
NetC27_1: C27.1 IC15.4(Vn)
NetC29_1: C29.1 IC17.2(Vp)
NetC30_1: C30.1 IC17.4(Vn)

### Notes on the sheet
- PCB COMPONENT DESCRIPTION
- LDL NUMBER
- Assembly Details
- Size
- Drawing File Name
- Revision
- http://rloop.org
- Scale
- A3
- Sheet Details
- N.T.S
- Sheet:
- Of:

### Library data of the parts
C24-C30 = 100n / 50V / 10% / SMD 0603: Capacitor, Ceramic Chip, 100nF (0.1uF), 50V, 5%, SMD 0603 [LCA016]; FMEDA__OPERATING__VOLTAGE_MIN: 0; FMEDA__OPERATING__VOLTAGE_MAX: 3.3; FMEDA__OPERATING__TEMP_MIN: -20; FMEDA__OPERATING__TEMP_TYP: 27; FMEDA__OPERATING__TEMP_MAX: 50; FMEDA__CHANNEL: COM; Value: 100n; FMEDA__FUNCTION_IN_SYSTEM: *; FMEDA__OPERATING__VOLTAGE_TYP: 3.3
IC15 IC17 = MAX14778ETP+: IC, Mux 25V, SMD QFN20 [LIC544]
IC16 = SN74HCT139DE4: IC, Dual 2-4 Demux, SMD SOIC-16
TP1-TP4 TP16-TP19 = SMD_TP: SMD Test Point; FMEDA__CHANNEL: COM; FMEDA__OPERATING__CURRENT_MAX: 0; FMEDA__OPERATING__TEMP_MAX: 50; FMEDA__OPERATING__TEMP_MIN: -20; FMEDA__OPERATING__TEMP_TYP: 27; FMEDA__OPERATING__VOLTAGE_MAX: 16; FMEDA__OPERATING__VOLTAGE_TYP: 12; FMEDA__OPERATING__CURRENT_MIN: 0; FMEDA__OPERATING__CURRENT_TYP: 0; FMEDA__OPERATING__VOLTAGE_MIN: 0

## Sheet LPCB218 - HEC1-4.SchDoc
size A3; Address1: Factory 10; Address2: 9-13 Dingley Avenue, Dandeong, VICTORIA 3175, AUSTRALIA; DocumentNumber: 6; Revision: 1; SheetNumber: 6; SheetTotal: 14; Lockie__PCB_SUB_ASSEMBLY: HEC 1-4; Lockie__PCB_ASSEMBLY: Command Node; Lockie__LDL: LPCB218; Lockie__PCB_DESCRIPTION: Command Node
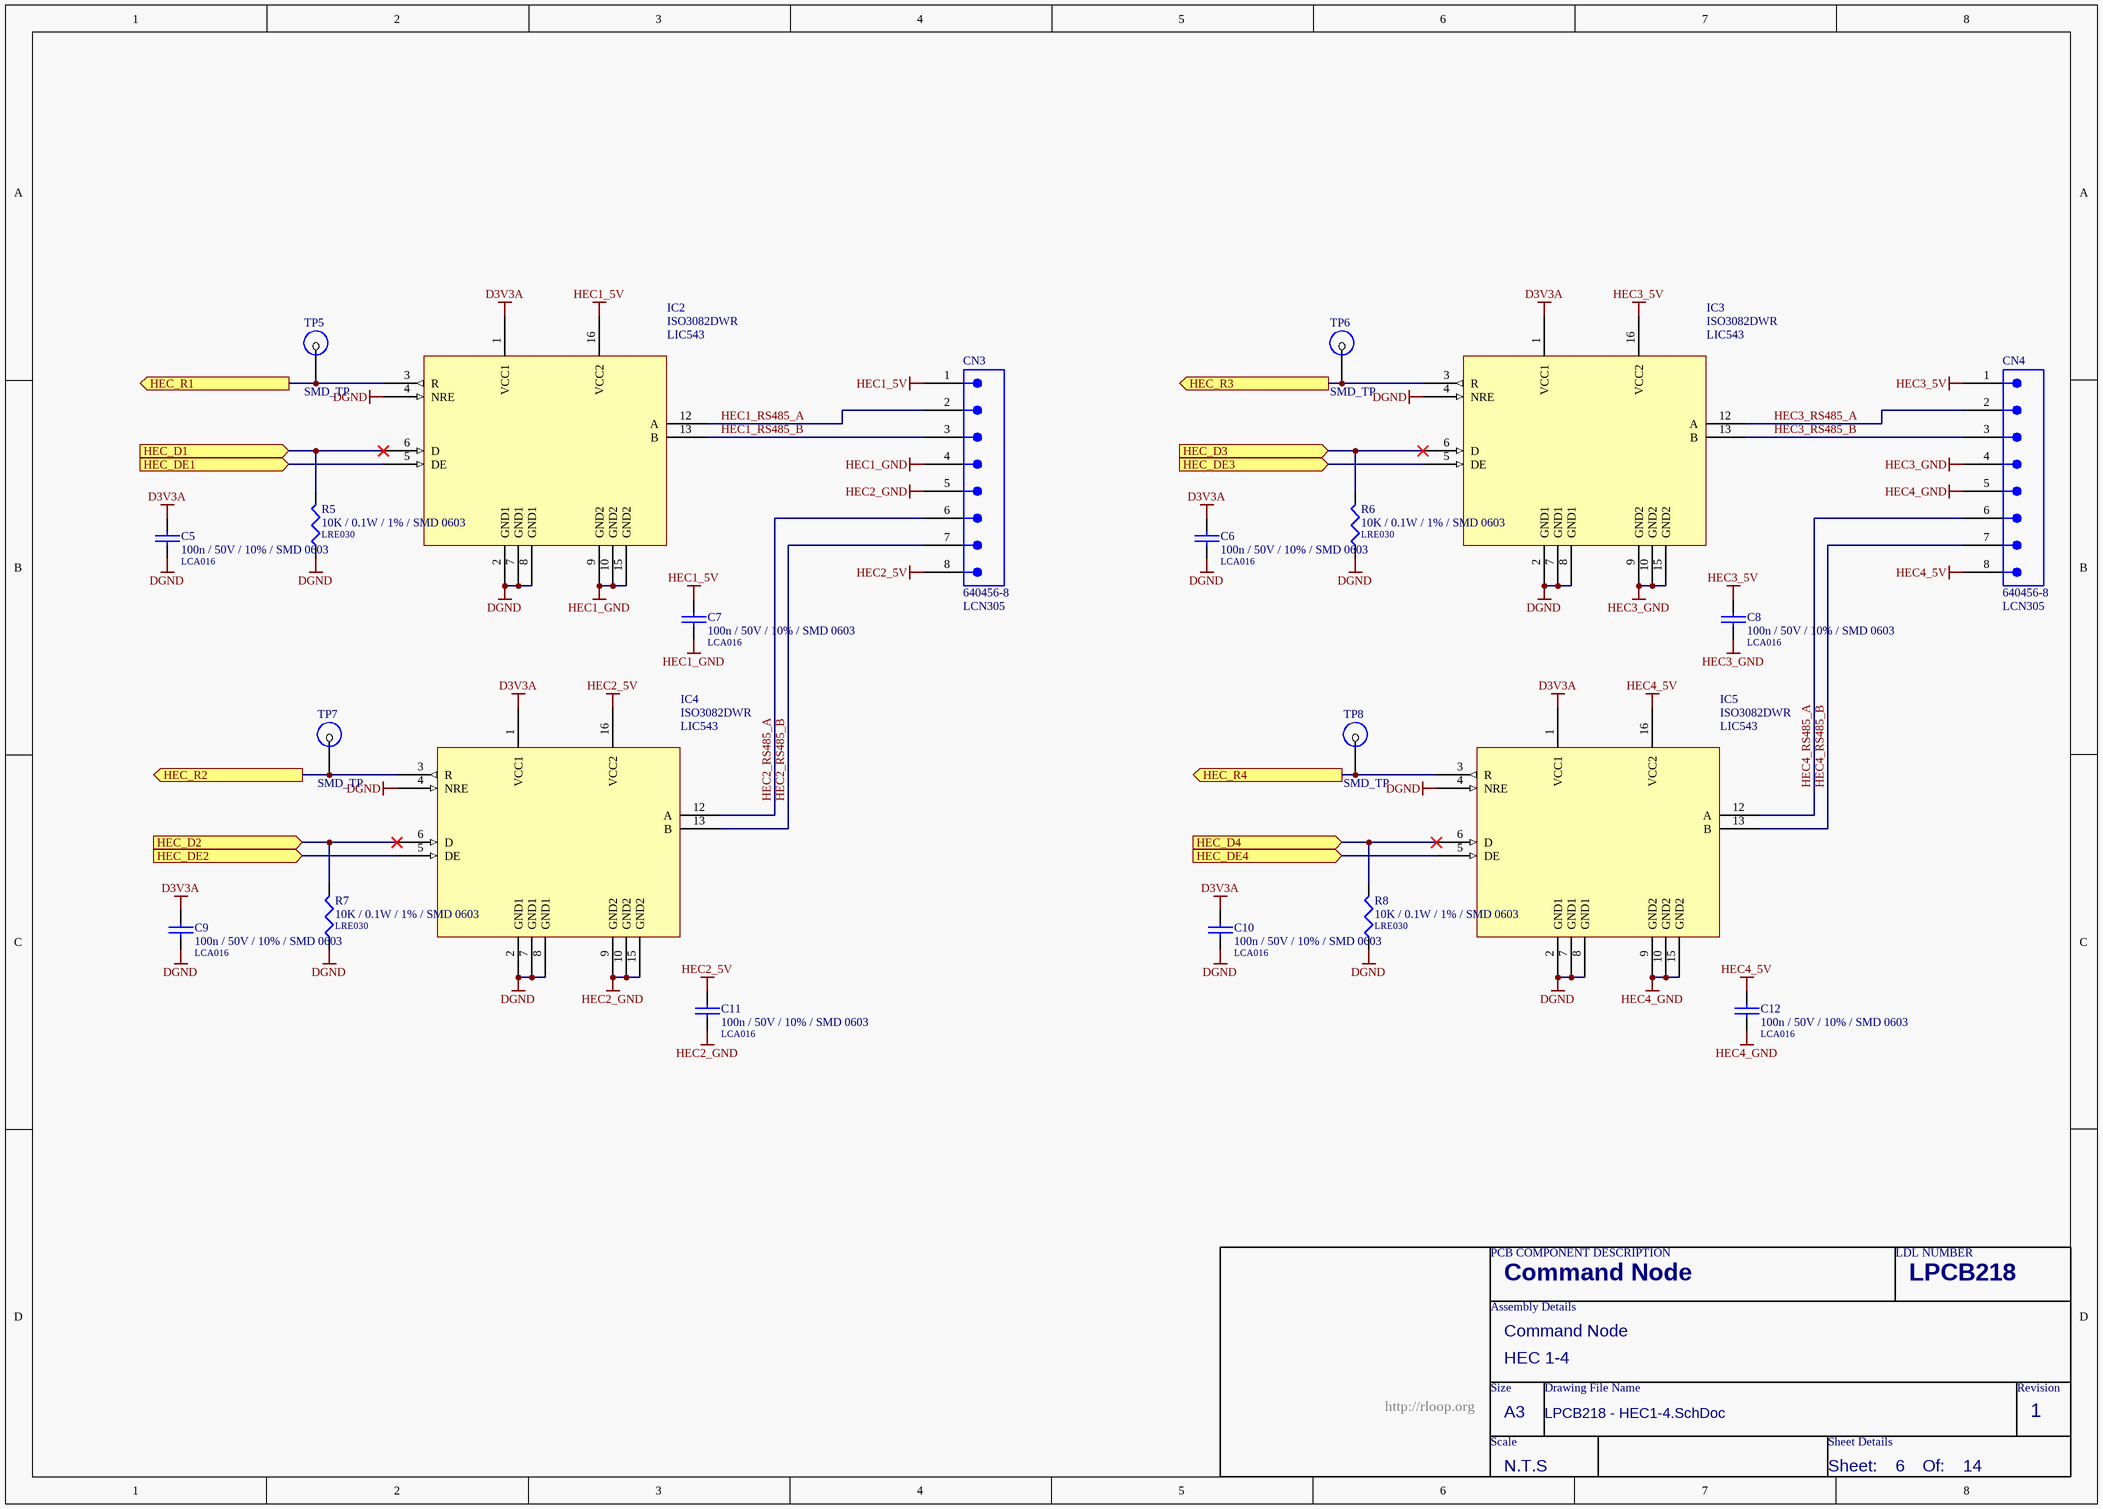
[diagram p6: LPCB218 - HEC1-4.SchDoc]

### Parts
C5  100n / 50V / 10% / SMD 0603  LDL_NUMBER: LCA016  [LFP011__CC1608-0603-IPC7351_B]
C6  100n / 50V / 10% / SMD 0603  LDL_NUMBER: LCA016  [LFP011__CC1608-0603-IPC7351_B]
C7  100n / 50V / 10% / SMD 0603  LDL_NUMBER: LCA016  [LFP011__CC1608-0603-IPC7351_B]
C8  100n / 50V / 10% / SMD 0603  LDL_NUMBER: LCA016  [LFP011__CC1608-0603-IPC7351_B]
C9  100n / 50V / 10% / SMD 0603  LDL_NUMBER: LCA016  [LFP011__CC1608-0603-IPC7351_B]
C10  100n / 50V / 10% / SMD 0603  LDL_NUMBER: LCA016  [LFP011__CC1608-0603-IPC7351_B]
C11  100n / 50V / 10% / SMD 0603  LDL_NUMBER: LCA016  [LFP011__CC1608-0603-IPC7351_B]
C12  100n / 50V / 10% / SMD 0603  LDL_NUMBER: LCA016  [LFP011__CC1608-0603-IPC7351_B]
CN3  640456-8  LDL_NUMBER: LCN305  [640456-8]
CN4  640456-8  LDL_NUMBER: LCN305  [640456-8]
IC2  ISO3082DWR  LDL_NUMBER: LIC543  [LFP068__SO-G16/G6.9]
IC3  ISO3082DWR  LDL_NUMBER: LIC543  [LFP068__SO-G16/G6.9]
IC4  ISO3082DWR  LDL_NUMBER: LIC543  [LFP068__SO-G16/G6.9]
IC5  ISO3082DWR  LDL_NUMBER: LIC543  [LFP068__SO-G16/G6.9]
R5  10K / 0.1W / 1% / SMD 0603  LDL_NUMBER: LRE030  [LFP020__CR1608-0603-IPC7351_B]
R6  10K / 0.1W / 1% / SMD 0603  LDL_NUMBER: LRE030  [LFP020__CR1608-0603-IPC7351_B]
R7  10K / 0.1W / 1% / SMD 0603  LDL_NUMBER: LRE030  [LFP020__CR1608-0603-IPC7351_B]
R8  10K / 0.1W / 1% / SMD 0603  LDL_NUMBER: LRE030  [LFP020__CR1608-0603-IPC7351_B]
TP5  SMD_TP  [SMD-TP]  (no BOM)
TP6  SMD_TP  [SMD-TP]  (no BOM)
TP7  SMD_TP  [SMD-TP]  (no BOM)
TP8  SMD_TP  [SMD-TP]  (no BOM)

### Ports
HEC_D1 (in), HEC_D2 (in), HEC_D3 (in), HEC_D4 (in), HEC_DE1 (in), HEC_DE2 (in), HEC_DE3 (in), HEC_DE4 (in), HEC_R1 (out), HEC_R2 (out), HEC_R3 (out), HEC_R4 (out)

### Nets
D3V3A: C5.1 C6.1 C9.1 C10.1 IC2.1(VCC1) IC3.1(VCC1) IC4.1(VCC1) IC5.1(VCC1)
DGND: C5.2 C6.2 C9.2 C10.2 IC2.2(GND1) IC2.4(NRE) IC2.7(GND1) IC2.8(GND1) IC3.2(GND1) IC3.4(NRE) IC3.7(GND1) IC3.8(GND1) IC4.2(GND1) IC4.4(NRE) IC4.7(GND1) IC4.8(GND1) IC5.2(GND1) IC5.4(NRE) IC5.7(GND1) IC5.8(GND1) R5.1 R6.1 R7.1 R8.1
HEC1_5V: C7.1 CN3.1 IC2.16(VCC2)
HEC1_GND: C7.2 CN3.4 IC2.9(GND2) IC2.10(GND2) IC2.15(GND2)
HEC2_5V: C11.1 CN3.8 IC4.16(VCC2)
HEC2_GND: C11.2 CN3.5 IC4.9(GND2) IC4.10(GND2) IC4.15(GND2)
HEC3_5V: C8.1 CN4.1 IC3.16(VCC2)
HEC3_GND: C8.2 CN4.4 IC3.9(GND2) IC3.10(GND2) IC3.15(GND2)
HEC4_5V: C12.1 CN4.8 IC5.16(VCC2)
HEC4_GND: C12.2 CN4.5 IC5.9(GND2) IC5.10(GND2) IC5.15(GND2)
HEC1_RS485_A: CN3.2 IC2.12(A)
HEC1_RS485_B: CN3.3 IC2.13(B)
HEC2_RS485_A: CN3.6 IC4.12(A)
HEC2_RS485_B: CN3.7 IC4.13(B)
HEC3_RS485_A: CN4.2 IC3.12(A)
HEC3_RS485_B: CN4.3 IC3.13(B)
HEC4_RS485_A: CN4.6 IC5.12(A)
HEC4_RS485_B: CN4.7 IC5.13(B)
HEC_D1: IC2.6(D) R5.2 ; port HEC_D1
HEC_D2: IC4.6(D) R7.2 ; port HEC_D2
HEC_D3: IC3.6(D) R6.2 ; port HEC_D3
HEC_D4: IC5.6(D) R8.2 ; port HEC_D4
HEC_DE1: IC2.5(DE) ; port HEC_DE1
HEC_DE2: IC4.5(DE) ; port HEC_DE2
HEC_DE3: IC3.5(DE) ; port HEC_DE3
HEC_DE4: IC5.5(DE) ; port HEC_DE4
HEC_R1: IC2.3(R) TP5.1 ; port HEC_R1
HEC_R2: IC4.3(R) TP7.1 ; port HEC_R2
HEC_R3: IC3.3(R) TP6.1 ; port HEC_R3
HEC_R4: IC5.3(R) TP8.1 ; port HEC_R4

### Notes on the sheet
- PCB COMPONENT DESCRIPTION
- LDL NUMBER
- Assembly Details
- Size
- Drawing File Name
- Revision
- http://rloop.org
- Scale
- A3
- Sheet Details
- N.T.S
- Sheet:
- Of:

### Library data of the parts
C5-C12 = 100n / 50V / 10% / SMD 0603: as C24 on sheet LPCB218 - RS485 MUX CONTROL; Value: 100n; FMEDA__FUNCTION_IN_SYSTEM: *; FMEDA__OPERATING__VOLTAGE_TYP: 3.3
CN3 CN4 = 640456-8: as CN1 on sheet LPCB218 - CHARGER INTERFACE; FMEDA__FUNCTION_IN_SYSTEM: *; FMEDA__OPERATING__CURRENT_MIN: 0; FMEDA__OPERATING__CURRENT_TYP: 0; FMEDA__OPERATING__VOLTAGE_MIN: 0
IC2-IC5 = ISO3082DWR: IC, RS485 Isolator, SMD SOIC 16 [LIC543]
R5-R8 = 10K / 0.1W / 1% / SMD 0603: Resistor, Ceramic Chip, 10K, 0.1W, 1%, SMD 0603 [LRE030]; FMEDA__OPERATING__POWER_MAX: 0; FMEDA__OPERATING__TEMP_MAX: 50; FMEDA__OPERATING__TEMP_MIN: -20; FMEDA__OPERATING__TEMP_TYP: 27; FMEDA__CHANNEL: COM; Value: 10K; FMEDA__OPERATING__POWER_MIN: 0; FMEDA__OPERATING__VOLTAGE_MAX: 0; FMEDA__OPERATING__VOLTAGE_MIN: 0; FMEDA__OPERATING__VOLTAGE_TYP: 0; FMEDA__FUNCTION_IN_SYSTEM: *
TP5-TP8 = SMD_TP: as TP1 on sheet LPCB218 - RS485 MUX CONTROL; FMEDA__OPERATING__CURRENT_MIN: 0; FMEDA__OPERATING__CURRENT_TYP: 0; FMEDA__OPERATING__VOLTAGE_MIN: 0

## Sheet LPCB218 - HEC5-8.SchDoc
size A3; Address1: Factory 10; Address2: 9-13 Dingley Avenue, Dandeong, VICTORIA 3175, AUSTRALIA; DocumentNumber: 7; Revision: 1; SheetNumber: 7; SheetTotal: 14; Lockie__PCB_SUB_ASSEMBLY: HEC 5-8; Lockie__PCB_ASSEMBLY: Command Node; Lockie__LDL: LPCB218; Lockie__PCB_DESCRIPTION: Command Node
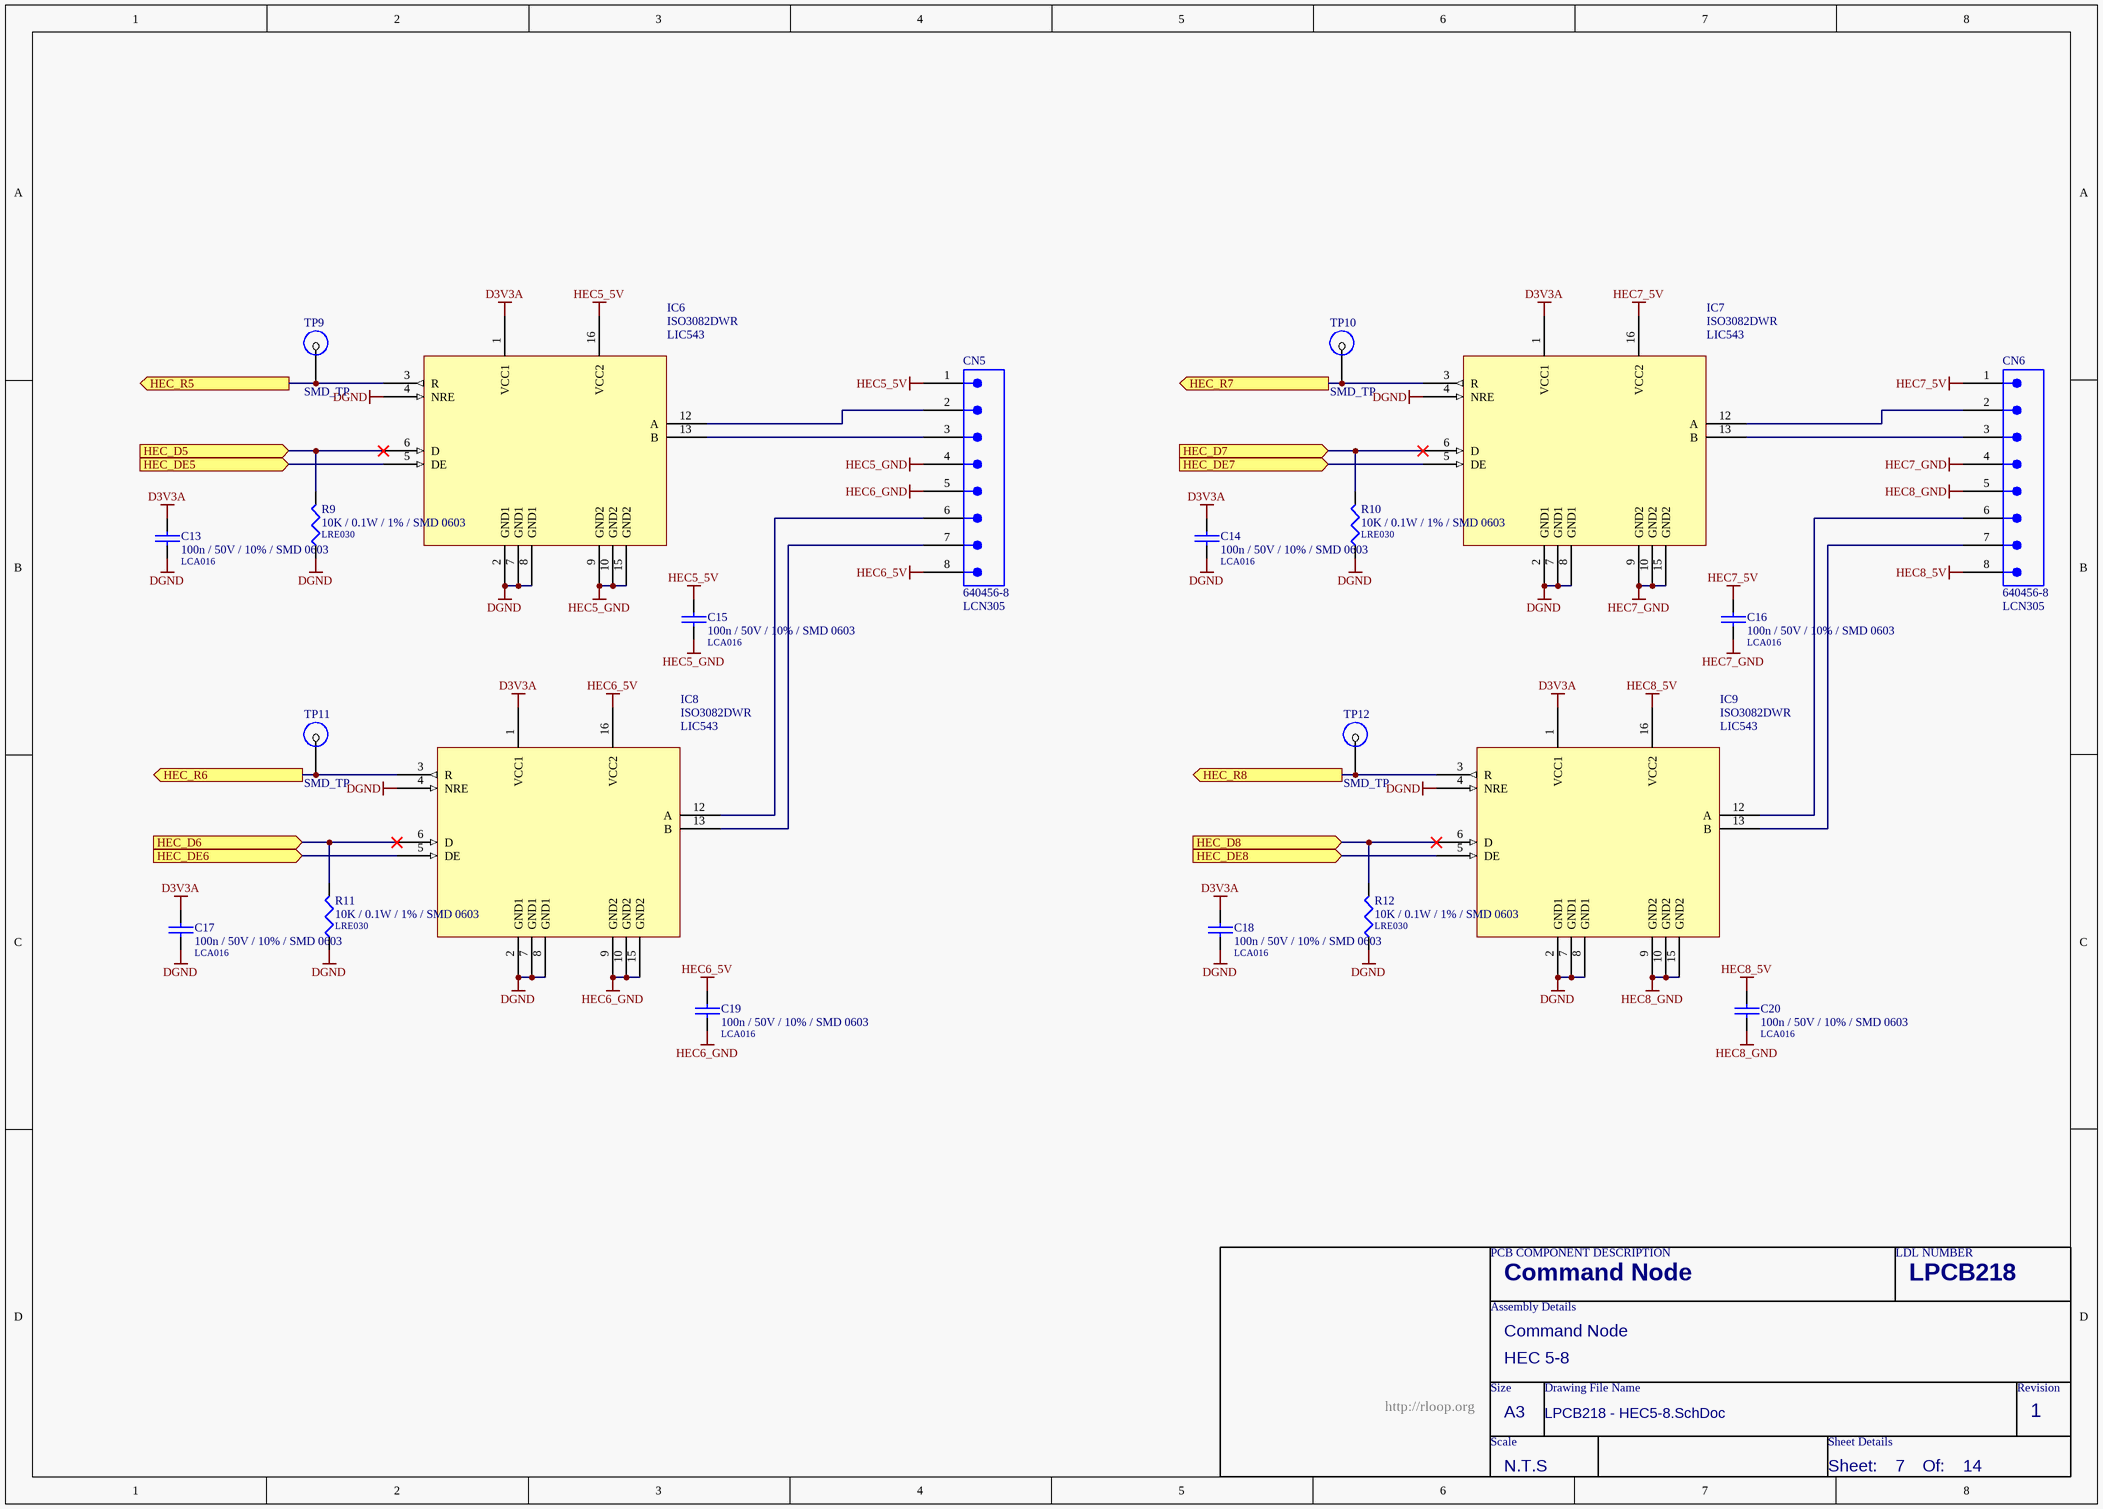
[diagram p7: LPCB218 - HEC5-8.SchDoc]

### Parts
C13  100n / 50V / 10% / SMD 0603  LDL_NUMBER: LCA016  [LFP011__CC1608-0603-IPC7351_B]
C14  100n / 50V / 10% / SMD 0603  LDL_NUMBER: LCA016  [LFP011__CC1608-0603-IPC7351_B]
C15  100n / 50V / 10% / SMD 0603  LDL_NUMBER: LCA016  [LFP011__CC1608-0603-IPC7351_B]
C16  100n / 50V / 10% / SMD 0603  LDL_NUMBER: LCA016  [LFP011__CC1608-0603-IPC7351_B]
C17  100n / 50V / 10% / SMD 0603  LDL_NUMBER: LCA016  [LFP011__CC1608-0603-IPC7351_B]
C18  100n / 50V / 10% / SMD 0603  LDL_NUMBER: LCA016  [LFP011__CC1608-0603-IPC7351_B]
C19  100n / 50V / 10% / SMD 0603  LDL_NUMBER: LCA016  [LFP011__CC1608-0603-IPC7351_B]
C20  100n / 50V / 10% / SMD 0603  LDL_NUMBER: LCA016  [LFP011__CC1608-0603-IPC7351_B]
CN5  640456-8  LDL_NUMBER: LCN305  [640456-8]
CN6  640456-8  LDL_NUMBER: LCN305  [640456-8]
IC6  ISO3082DWR  LDL_NUMBER: LIC543  [LFP068__SO-G16/G6.9]
IC7  ISO3082DWR  LDL_NUMBER: LIC543  [LFP068__SO-G16/G6.9]
IC8  ISO3082DWR  LDL_NUMBER: LIC543  [LFP068__SO-G16/G6.9]
IC9  ISO3082DWR  LDL_NUMBER: LIC543  [LFP068__SO-G16/G6.9]
R9  10K / 0.1W / 1% / SMD 0603  LDL_NUMBER: LRE030  [LFP020__CR1608-0603-IPC7351_B]
R10  10K / 0.1W / 1% / SMD 0603  LDL_NUMBER: LRE030  [LFP020__CR1608-0603-IPC7351_B]
R11  10K / 0.1W / 1% / SMD 0603  LDL_NUMBER: LRE030  [LFP020__CR1608-0603-IPC7351_B]
R12  10K / 0.1W / 1% / SMD 0603  LDL_NUMBER: LRE030  [LFP020__CR1608-0603-IPC7351_B]
TP9  SMD_TP  [SMD-TP]  (no BOM)
TP10  SMD_TP  [SMD-TP]  (no BOM)
TP11  SMD_TP  [SMD-TP]  (no BOM)
TP12  SMD_TP  [SMD-TP]  (no BOM)

### Ports
HEC_D5 (in), HEC_D6 (in), HEC_D7 (in), HEC_D8 (in), HEC_DE5 (in), HEC_DE6 (in), HEC_DE7 (in), HEC_DE8 (in), HEC_R5 (out), HEC_R6 (out), HEC_R7 (out), HEC_R8 (out)

### Nets
D3V3A: C13.1 C14.1 C17.1 C18.1 IC6.1(VCC1) IC7.1(VCC1) IC8.1(VCC1) IC9.1(VCC1)
DGND: C13.2 C14.2 C17.2 C18.2 IC6.2(GND1) IC6.4(NRE) IC6.7(GND1) IC6.8(GND1) IC7.2(GND1) IC7.4(NRE) IC7.7(GND1) IC7.8(GND1) IC8.2(GND1) IC8.4(NRE) IC8.7(GND1) IC8.8(GND1) IC9.2(GND1) IC9.4(NRE) IC9.7(GND1) IC9.8(GND1) R9.1 R10.1 R11.1 R12.1
HEC5_5V: C15.1 CN5.1 IC6.16(VCC2)
HEC5_GND: C15.2 CN5.4 IC6.9(GND2) IC6.10(GND2) IC6.15(GND2)
HEC6_5V: C19.1 CN5.8 IC8.16(VCC2)
HEC6_GND: C19.2 CN5.5 IC8.9(GND2) IC8.10(GND2) IC8.15(GND2)
HEC7_5V: C16.1 CN6.1 IC7.16(VCC2)
HEC7_GND: C16.2 CN6.4 IC7.9(GND2) IC7.10(GND2) IC7.15(GND2)
HEC8_5V: C20.1 CN6.8 IC9.16(VCC2)
HEC8_GND: C20.2 CN6.5 IC9.9(GND2) IC9.10(GND2) IC9.15(GND2)
HEC_D5: IC6.6(D) R9.2 ; port HEC_D5
HEC_D6: IC8.6(D) R11.2 ; port HEC_D6
HEC_D7: IC7.6(D) R10.2 ; port HEC_D7
HEC_D8: IC9.6(D) R12.2 ; port HEC_D8
HEC_DE5: IC6.5(DE) ; port HEC_DE5
HEC_DE6: IC8.5(DE) ; port HEC_DE6
HEC_DE7: IC7.5(DE) ; port HEC_DE7
HEC_DE8: IC9.5(DE) ; port HEC_DE8
HEC_R5: IC6.3(R) TP9.1 ; port HEC_R5
HEC_R6: IC8.3(R) TP11.1 ; port HEC_R6
HEC_R7: IC7.3(R) TP10.1 ; port HEC_R7
HEC_R8: IC9.3(R) TP12.1 ; port HEC_R8
NetCN5_2: CN5.2 IC6.12(A)
NetCN5_3: CN5.3 IC6.13(B)
NetCN5_6: CN5.6 IC8.12(A)
NetCN5_7: CN5.7 IC8.13(B)
NetCN6_2: CN6.2 IC7.12(A)
NetCN6_3: CN6.3 IC7.13(B)
NetCN6_6: CN6.6 IC9.12(A)
NetCN6_7: CN6.7 IC9.13(B)

### Notes on the sheet
- PCB COMPONENT DESCRIPTION
- LDL NUMBER
- Assembly Details
- Size
- Drawing File Name
- Revision
- http://rloop.org
- Scale
- A3
- Sheet Details
- N.T.S
- Sheet:
- Of:

### Library data of the parts
C13-C20 = 100n / 50V / 10% / SMD 0603: as C24 on sheet LPCB218 - RS485 MUX CONTROL; Value: 100n; FMEDA__FUNCTION_IN_SYSTEM: *; FMEDA__OPERATING__VOLTAGE_TYP: 3.3
CN5 CN6 = 640456-8: as CN1 on sheet LPCB218 - CHARGER INTERFACE; FMEDA__FUNCTION_IN_SYSTEM: *; FMEDA__OPERATING__CURRENT_MIN: 0; FMEDA__OPERATING__CURRENT_TYP: 0; FMEDA__OPERATING__VOLTAGE_MIN: 0
IC6-IC9 = ISO3082DWR: IC, RS485 Isolator, SMD SOIC 16 [LIC543]
R9-R12 = 10K / 0.1W / 1% / SMD 0603: as R5 on sheet LPCB218 - HEC1-4; Value: 10K; FMEDA__OPERATING__POWER_MIN: 0; FMEDA__OPERATING__VOLTAGE_MAX: 0; FMEDA__OPERATING__VOLTAGE_MIN: 0; FMEDA__OPERATING__VOLTAGE_TYP: 0; FMEDA__FUNCTION_IN_SYSTEM: *
TP9-TP12 = SMD_TP: as TP1 on sheet LPCB218 - RS485 MUX CONTROL; FMEDA__OPERATING__CURRENT_MIN: 0; FMEDA__OPERATING__CURRENT_TYP: 0; FMEDA__OPERATING__VOLTAGE_MIN: 0

## Sheet LPCB218 - PARK BRAKE.SchDoc
size A3; Address1: Factory 10; Address2: 9-13 Dingley Avenue, Dandeong, VICTORIA 3175, AUSTRALIA; DocumentNumber: 14; Revision: 1; SheetNumber: 14; SheetTotal: 14; Lockie__PCB_SUB_ASSEMBLY: Park Brake; Lockie__PCB_ASSEMBLY: Command Node; Lockie__LDL: LPCB218; Lockie__PCB_DESCRIPTION: Command Node
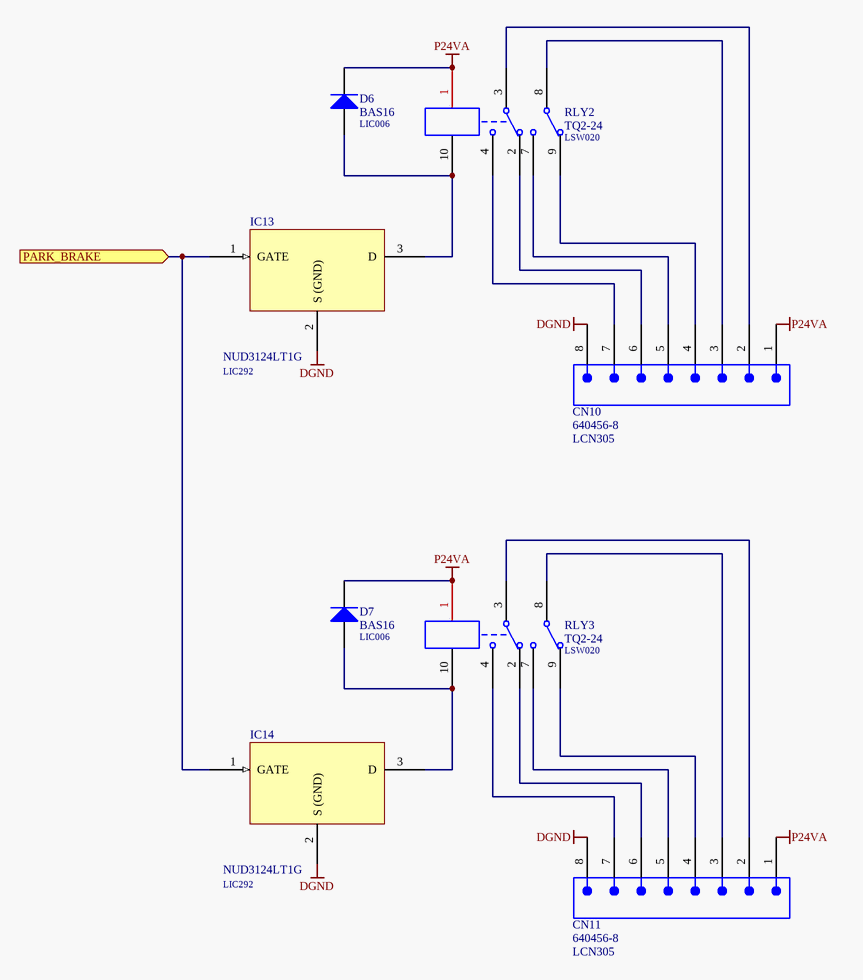
[diagram p8: LPCB218 - PARK BRAKE.SchDoc]

### Parts
CN10  640456-8  LDL_NUMBER: LCN305  [640456-8]
CN11  640456-8  LDL_NUMBER: LCN305  [640456-8]
D6  BAS16  LDL_NUMBER: LIC006  [LFP021__SOT23]
D7  BAS16  LDL_NUMBER: LIC006  [LFP021__SOT23]
IC13  NUD3124LT1G  LDL_NUMBER: LIC292  [LFP021__SOT23]
IC14  NUD3124LT1G  LDL_NUMBER: LIC292  [LFP021__SOT23]
RLY2  TQ2-24  LDL_NUMBER: LSW020  [TQ2]
RLY3  TQ2-24  LDL_NUMBER: LSW020  [TQ2]

### Ports
PARK_BRAKE (in)

### Nets
DGND: CN10.8 CN11.8 IC13.2(S_(GND)) IC14.2(S_(GND))
P24VA: CN10.1 CN11.1 D6.3(K) D7.3(K) RLY2.1 RLY3.1
PARK_BRAKE: IC13.1(GATE) IC14.1(GATE) ; port PARK_BRAKE
NetCN10_2: CN10.2 RLY2.3
NetCN10_3: CN10.3 RLY2.8
NetCN10_4: CN10.4 RLY2.9
NetCN10_5: CN10.5 RLY2.7
NetCN10_6: CN10.6 RLY2.2
NetCN10_7: CN10.7 RLY2.4
NetCN11_2: CN11.2 RLY3.3
NetCN11_3: CN11.3 RLY3.8
NetCN11_4: CN11.4 RLY3.9
NetCN11_5: CN11.5 RLY3.7
NetCN11_6: CN11.6 RLY3.2
NetCN11_7: CN11.7 RLY3.4
NetD6_1: D6.1(A) IC13.3(D) RLY2.10
NetD7_1: D7.1(A) IC14.3(D) RLY3.10

### Notes on the sheet
- PCB COMPONENT DESCRIPTION
- LDL NUMBER
- Assembly Details
- Size
- Drawing File Name
- Revision
- http://rloop.org
- Scale
- A3
- Sheet Details
- N.T.S
- Sheet:
- Of:

### Library data of the parts
CN10 CN11 = 640456-8: as CN1 on sheet LPCB218 - CHARGER INTERFACE; FMEDA__FUNCTION_IN_SYSTEM: *; FMEDA__OPERATING__CURRENT_MIN: 0; FMEDA__OPERATING__CURRENT_TYP: 0; FMEDA__OPERATING__VOLTAGE_MIN: 0
D6 D7 = BAS16: as D1 on sheet LPCB218 - LIFT MECH RELAY; FMEDA__OPERATING__CURRENT_MAX: 0; FMEDA__OPERATING__VOLTAGE_MIN: 0; FMEDA__OPERATING__VOLTAGE_MAX: 0; FMEDA__FUNCTION_IN_SYSTEM: *; FMEDA__OPERATING__CURRENT_TYP: 0; FMEDA__OPERATING__VOLTAGE_TYP: 0
IC13 IC14 = NUD3124LT1G: as IC10 on sheet LPCB218 - LIFT MECH RELAY; FMEDA__FUNCTION_IN_SYSTEM: *; FMEDA__OPERATING__POWER_MIN: 0
RLY2 RLY3 = TQ2-24: as RLY1 on sheet LPCB218 - LIFT MECH RELAY; Revision: July-2002: Re-released for DXP Platform.

## Sheet LPCB218 - MLP INTERFACE.SchDoc
size A3; Address1: Factory 10; Address2: 9-13 Dingley Avenue, Dandeong, VICTORIA 3175, AUSTRALIA; DocumentNumber: 12; Revision: 1; SheetNumber: 12; SheetTotal: 14; Lockie__PCB_SUB_ASSEMBLY: MLP Interface; Lockie__PCB_ASSEMBLY: Command Node; Lockie__LDL: LPCB218; Lockie__PCB_DESCRIPTION: Command Node
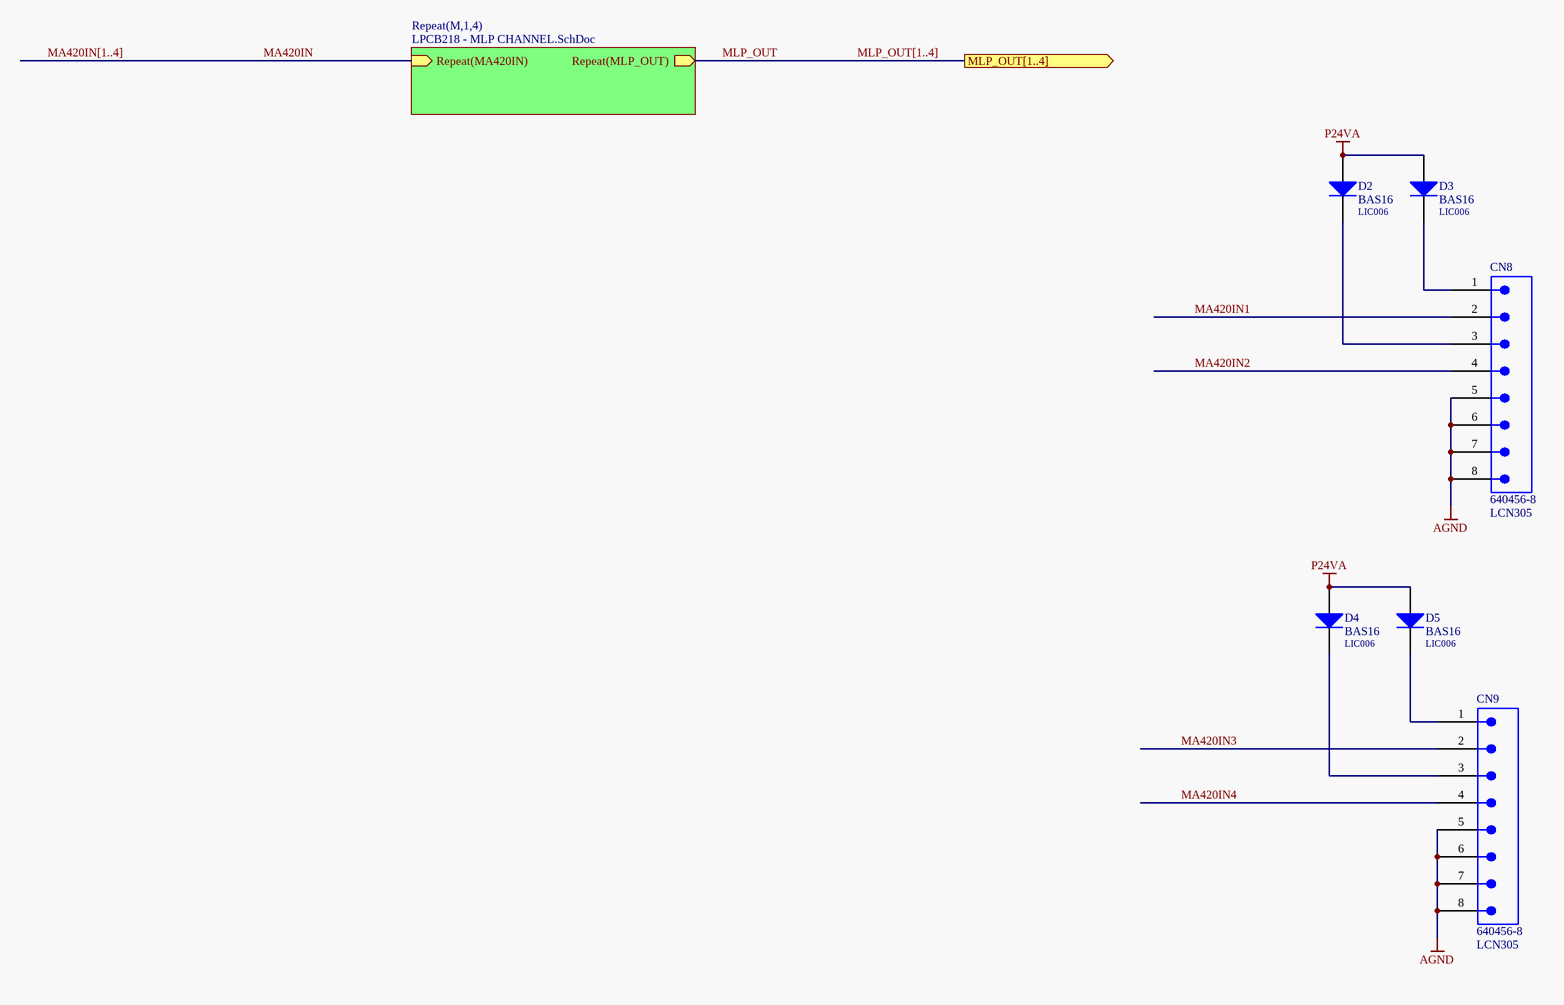
[diagram p9: LPCB218 - MLP INTERFACE.SchDoc]

### Parts
CN8  640456-8  LDL_NUMBER: LCN305  [640456-8]
CN9  640456-8  LDL_NUMBER: LCN305  [640456-8]
D2  BAS16  LDL_NUMBER: LIC006  [LFP021__SOT23]
D3  BAS16  LDL_NUMBER: LIC006  [LFP021__SOT23]
D4  BAS16  LDL_NUMBER: LIC006  [LFP021__SOT23]
D5  BAS16  LDL_NUMBER: LIC006  [LFP021__SOT23]

### Sub-sheets
Repeat(M,1,4) = LPCB218 - MLP CHANNEL.SchDoc: Repeat(MA420IN) (in), Repeat(MLP_OUT) (out)

### Ports
MLP_OUT[1..4] (out)

### Nets
AGND: CN8.5 CN8.6 CN8.7 CN8.8 CN9.5 CN9.6 CN9.7 CN9.8
P24VA: D2.1(A) D3.1(A) D4.1(A) D5.1(A)
MA420IN: sheet Repeat(M,1,4)/Repeat(MA420IN)
MA420IN1: CN8.2
MA420IN2: CN8.4
MA420IN3: CN9.2
MA420IN4: CN9.4
MLP_OUT: sheet Repeat(M,1,4)/Repeat(MLP_OUT)
NetCN8_1: CN8.1 D3.3(K)
NetCN8_3: CN8.3 D2.3(K)
NetCN9_1: CN9.1 D5.3(K)
NetCN9_3: CN9.3 D4.3(K)

### Buses and harness runs
bus MA420IN[1..4]
bus MLP_OUT[1..4] = port MLP_OUT[1..4]

### Notes on the sheet
- PCB COMPONENT DESCRIPTION
- LDL NUMBER
- Assembly Details
- Size
- Drawing File Name
- Revision
- http://rloop.org
- Scale
- A3
- Sheet Details
- N.T.S
- Sheet:
- Of:

### Library data of the parts
CN8 CN9 = 640456-8: as CN1 on sheet LPCB218 - CHARGER INTERFACE; FMEDA__FUNCTION_IN_SYSTEM: *; FMEDA__OPERATING__CURRENT_MIN: 0; FMEDA__OPERATING__CURRENT_TYP: 0; FMEDA__OPERATING__VOLTAGE_MIN: 0
D2-D5 = BAS16: as D1 on sheet LPCB218 - LIFT MECH RELAY; FMEDA__OPERATING__CURRENT_MAX: 0; FMEDA__OPERATING__VOLTAGE_MIN: 0; FMEDA__OPERATING__VOLTAGE_MAX: 0; FMEDA__FUNCTION_IN_SYSTEM: *; FMEDA__OPERATING__CURRENT_TYP: 0; FMEDA__OPERATING__VOLTAGE_TYP: 0

## Sheet LPCB218 - MLP CHANNEL.SchDoc
size A3; Address1: Factory 10; Address2: 9-13 Dingley Avenue, Dandeong, VICTORIA 3175, AUSTRALIA; DocumentNumber: 13; Revision: 1; SheetNumber: 13; SheetTotal: 14; Lockie__PCB_SUB_ASSEMBLY: MLP Channel; Lockie__PCB_ASSEMBLY: Command Node; Lockie__LDL: LPCB218; Lockie__PCB_DESCRIPTION: Command Node
Used 4 times, as channels U_LPCB218 - MLP INTERFACE/M1, U_LPCB218 - MLP INTERFACE/M2, U_LPCB218 - MLP INTERFACE/M3, U_LPCB218 - MLP INTERFACE/M4. Parts and nets are listed once, with the designators drawn on the sheet.
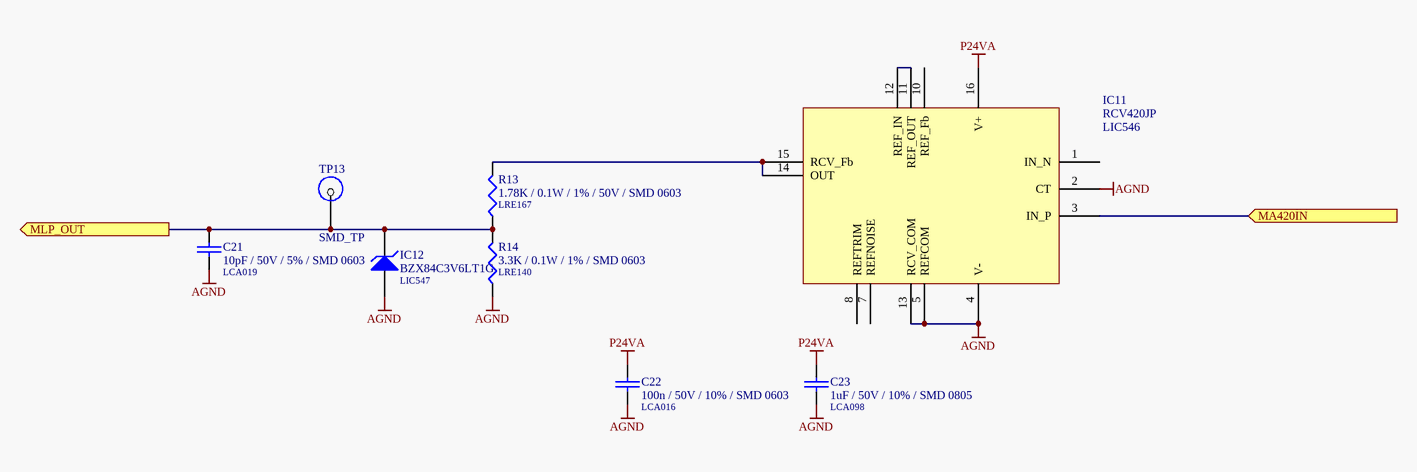
[diagram p10: LPCB218 - MLP CHANNEL.SchDoc]

### Parts
C21  10pF / 50V / 5% / SMD 0603  LDL_NUMBER: LCA019  [LFP011__CC1608-0603-IPC7351_B]
C22  100n / 50V / 10% / SMD 0603  LDL_NUMBER: LCA016  [LFP011__CC1608-0603-IPC7351_B]
C23  1uF / 50V / 10% / SMD 0805  LDL_NUMBER: LCA098  [LFP010__CC2012-0805-IPC7351_B]
IC11  RCV420JP  LDL_NUMBER: LIC546  [DIP-P16/X1.5]
IC12  BZX84C3V6LT1G  LDL_NUMBER: LIC547  [LFP021__SOT23]
R13  1.78K / 0.1W / 1% / 50V / SMD 0603  LDL_NUMBER: LRE167  [LFP020__CR1608-0603-IPC7351_B]
R14  3.3K / 0.1W / 1% / SMD 0603  LDL_NUMBER: LRE140  [LFP020__CR1608-0603-IPC7351_B]
TP13  SMD_TP  [SMD-TP]  (no BOM)

### Ports
MA420IN (in), MLP_OUT (out)

### Nets
AGND: C21.2 C22.2 C23.2 IC11.2(CT) IC11.4(V-) IC11.5(REFCOM) IC11.13(RCV_COM) IC12.1(A) R14.1
P24VA: C22.1 C23.1 IC11.16(V+)
MA420IN: IC11.3(IN_P) ; port MA420IN
MLP_OUT: C21.1 IC12.3(K) R13.1 R14.2 TP13.1 ; port MLP_OUT
NetIC11_11: IC11.11(REF_OUT) IC11.12(REF_IN)
NetIC11_14: IC11.14(OUT) IC11.15(RCV_Fb) R13.2

Not connected (* = marked no-connect by the designer): IC11 1(IN_N) 7(REFNOISE) 8(REFTRIM) 10(REF_Fb)

### Channels
U_LPCB218 - MLP INTERFACE/M1: designators end in _M1; ports MA420IN=MA420IN1 MLP_OUT=MLP_OUT1
U_LPCB218 - MLP INTERFACE/M2: designators end in _M2; ports MA420IN=MA420IN2 MLP_OUT=MLP_OUT2
U_LPCB218 - MLP INTERFACE/M3: designators end in _M3; ports MA420IN=MA420IN3 MLP_OUT=MLP_OUT3
U_LPCB218 - MLP INTERFACE/M4: designators end in _M4; ports MA420IN=MA420IN4 MLP_OUT=MLP_OUT4

### Notes on the sheet
- PCB COMPONENT DESCRIPTION
- LDL NUMBER
- Assembly Details
- Size
- Drawing File Name
- Revision
- http://rloop.org
- Scale
- A3
- Sheet Details
- N.T.S
- Sheet:
- Of:

### Library data of the parts
C21 = 10pF / 50V / 5% / SMD 0603: Capacitor, Ceramic Chip, 10pF, 50V, 5%, SMD 0603 [LCA019]; Value: 10p; FMEDA__OPERATING__VOLTAGE_MAX: 3.3; FMEDA__OPERATING__VOLTAGE_MIN: 0; FMEDA__OPERATING__TEMP_MAX: 50; FMEDA__OPERATING__TEMP_MIN: -20; FMEDA__OPERATING__TEMP_TYP: 27; FMEDA__CHANNEL: COM; FMEDA__OPERATING__VOLTAGE_TYP: 3.3; FMEDA__FUNCTION_IN_SYSTEM: *
C22 = 100n / 50V / 10% / SMD 0603: as C24 on sheet LPCB218 - RS485 MUX CONTROL; Value: 100n; FMEDA__FUNCTION_IN_SYSTEM: *; FMEDA__OPERATING__VOLTAGE_TYP: 3.3
C23 = 1uF / 50V / 10% / SMD 0805: Capacitor, Ceramic Chip, 1uF, 50V, SMD 0805 [LCA098]; Value: 1u; FMEDA__OPERATING__VOLTAGE_MAX: 3.3; FMEDA__OPERATING__VOLTAGE_MIN: 0; FMEDA__OPERATING__TEMP_MAX: 50; FMEDA__OPERATING__TEMP_MIN: -20; FMEDA__OPERATING__TEMP_TYP: 27; FMEDA__CHANNEL: COM; FMEDA__OPERATING__VOLTAGE_TYP: 3.3; FMEDA__FUNCTION_IN_SYSTEM: *
IC11 = RCV420JP: IC, 4-20mA Interface, DIP16 [LIC546]
IC12 = BZX84C3V6LT1G: Diode, Zener, 3.6V, 0.225W, SMD [LIC083]; FMEDA__OPERATING__TEMP_MAX: 50; FMEDA__OPERATING__TEMP_MIN: -20; FMEDA__OPERATING__TEMP_TYP: 27; FMEDA__OPERATING__VOLTAGE_MAX: 0; FMEDA__CHANNEL: COM; Revision: 17-Jul-2002: Re-released for DXP Platform.; FMEDA__FUNCTION_IN_SYSTEM: *; FMEDA__OPERATING__VOLTAGE_MIN: 0; FMEDA__OPERATING__VOLTAGE_TYP: 0; FMEDA__OPERATING__CURRENT_MAX: 0; FMEDA__OPERATING__CURRENT_MIN: 0; FMEDA__OPERATING__CURRENT_TYP: 0
R13 = 1.78K / 0.1W / 1% / 50V / SMD 0603: Resistor, Ceramic Chip, 1.78K, 0.1W, 1%, SMD 0603 [LRE167]; FMEDA__OPERATING__POWER_MAX: 0.01; FMEDA__OPERATING__POWER_MIN: 0; FMEDA__OPERATING__TEMP_MAX: 50; FMEDA__OPERATING__TEMP_MIN: -20; FMEDA__OPERATING__TEMP_TYP: 27; FMEDA__CHANNEL: COM; Value: 1.78K; FMEDA__OPERATING__VOLTAGE_MAX: 0; FMEDA__OPERATING__VOLTAGE_MIN: 0; FMEDA__OPERATING__VOLTAGE_TYP: 0; FMEDA__FUNCTION_IN_SYSTEM: *
R14 = 3.3K / 0.1W / 1% / SMD 0603: Resistor, Ceramic Chip, 3.3K0, 0.1W, 1%, SMD 0603 [LRE140]; FMEDA__OPERATING__POWER_MAX: 0; FMEDA__OPERATING__TEMP_MAX: 50; FMEDA__OPERATING__TEMP_MIN: -20; FMEDA__OPERATING__TEMP_TYP: 27; FMEDA__CHANNEL: COM; Value: 3.3K; FMEDA__OPERATING__POWER_MIN: 0; FMEDA__OPERATING__VOLTAGE_MAX: 0; FMEDA__OPERATING__VOLTAGE_MIN: 0; FMEDA__OPERATING__VOLTAGE_TYP: 0; FMEDA__FUNCTION_IN_SYSTEM: *
TP13 = SMD_TP: as TP1 on sheet LPCB218 - RS485 MUX CONTROL; FMEDA__OPERATING__CURRENT_MIN: 0; FMEDA__OPERATING__CURRENT_TYP: 0; FMEDA__OPERATING__VOLTAGE_MIN: 0

## Sheet LPCB218 - CORE INTERFACE.SchDoc
size A3; Address1: Factory 10; Address2: 9-13 Dingley Avenue, Dandeong, VICTORIA 3175, AUSTRALIA; DocumentNumber: 3; Revision: 1; SheetNumber: 3; SheetTotal: 14; Lockie__PCB_SUB_ASSEMBLY: Core Interface; Lockie__PCB_ASSEMBLY: Command Node; Lockie__LDL: LPCB218; Lockie__PCB_DESCRIPTION: Command Node
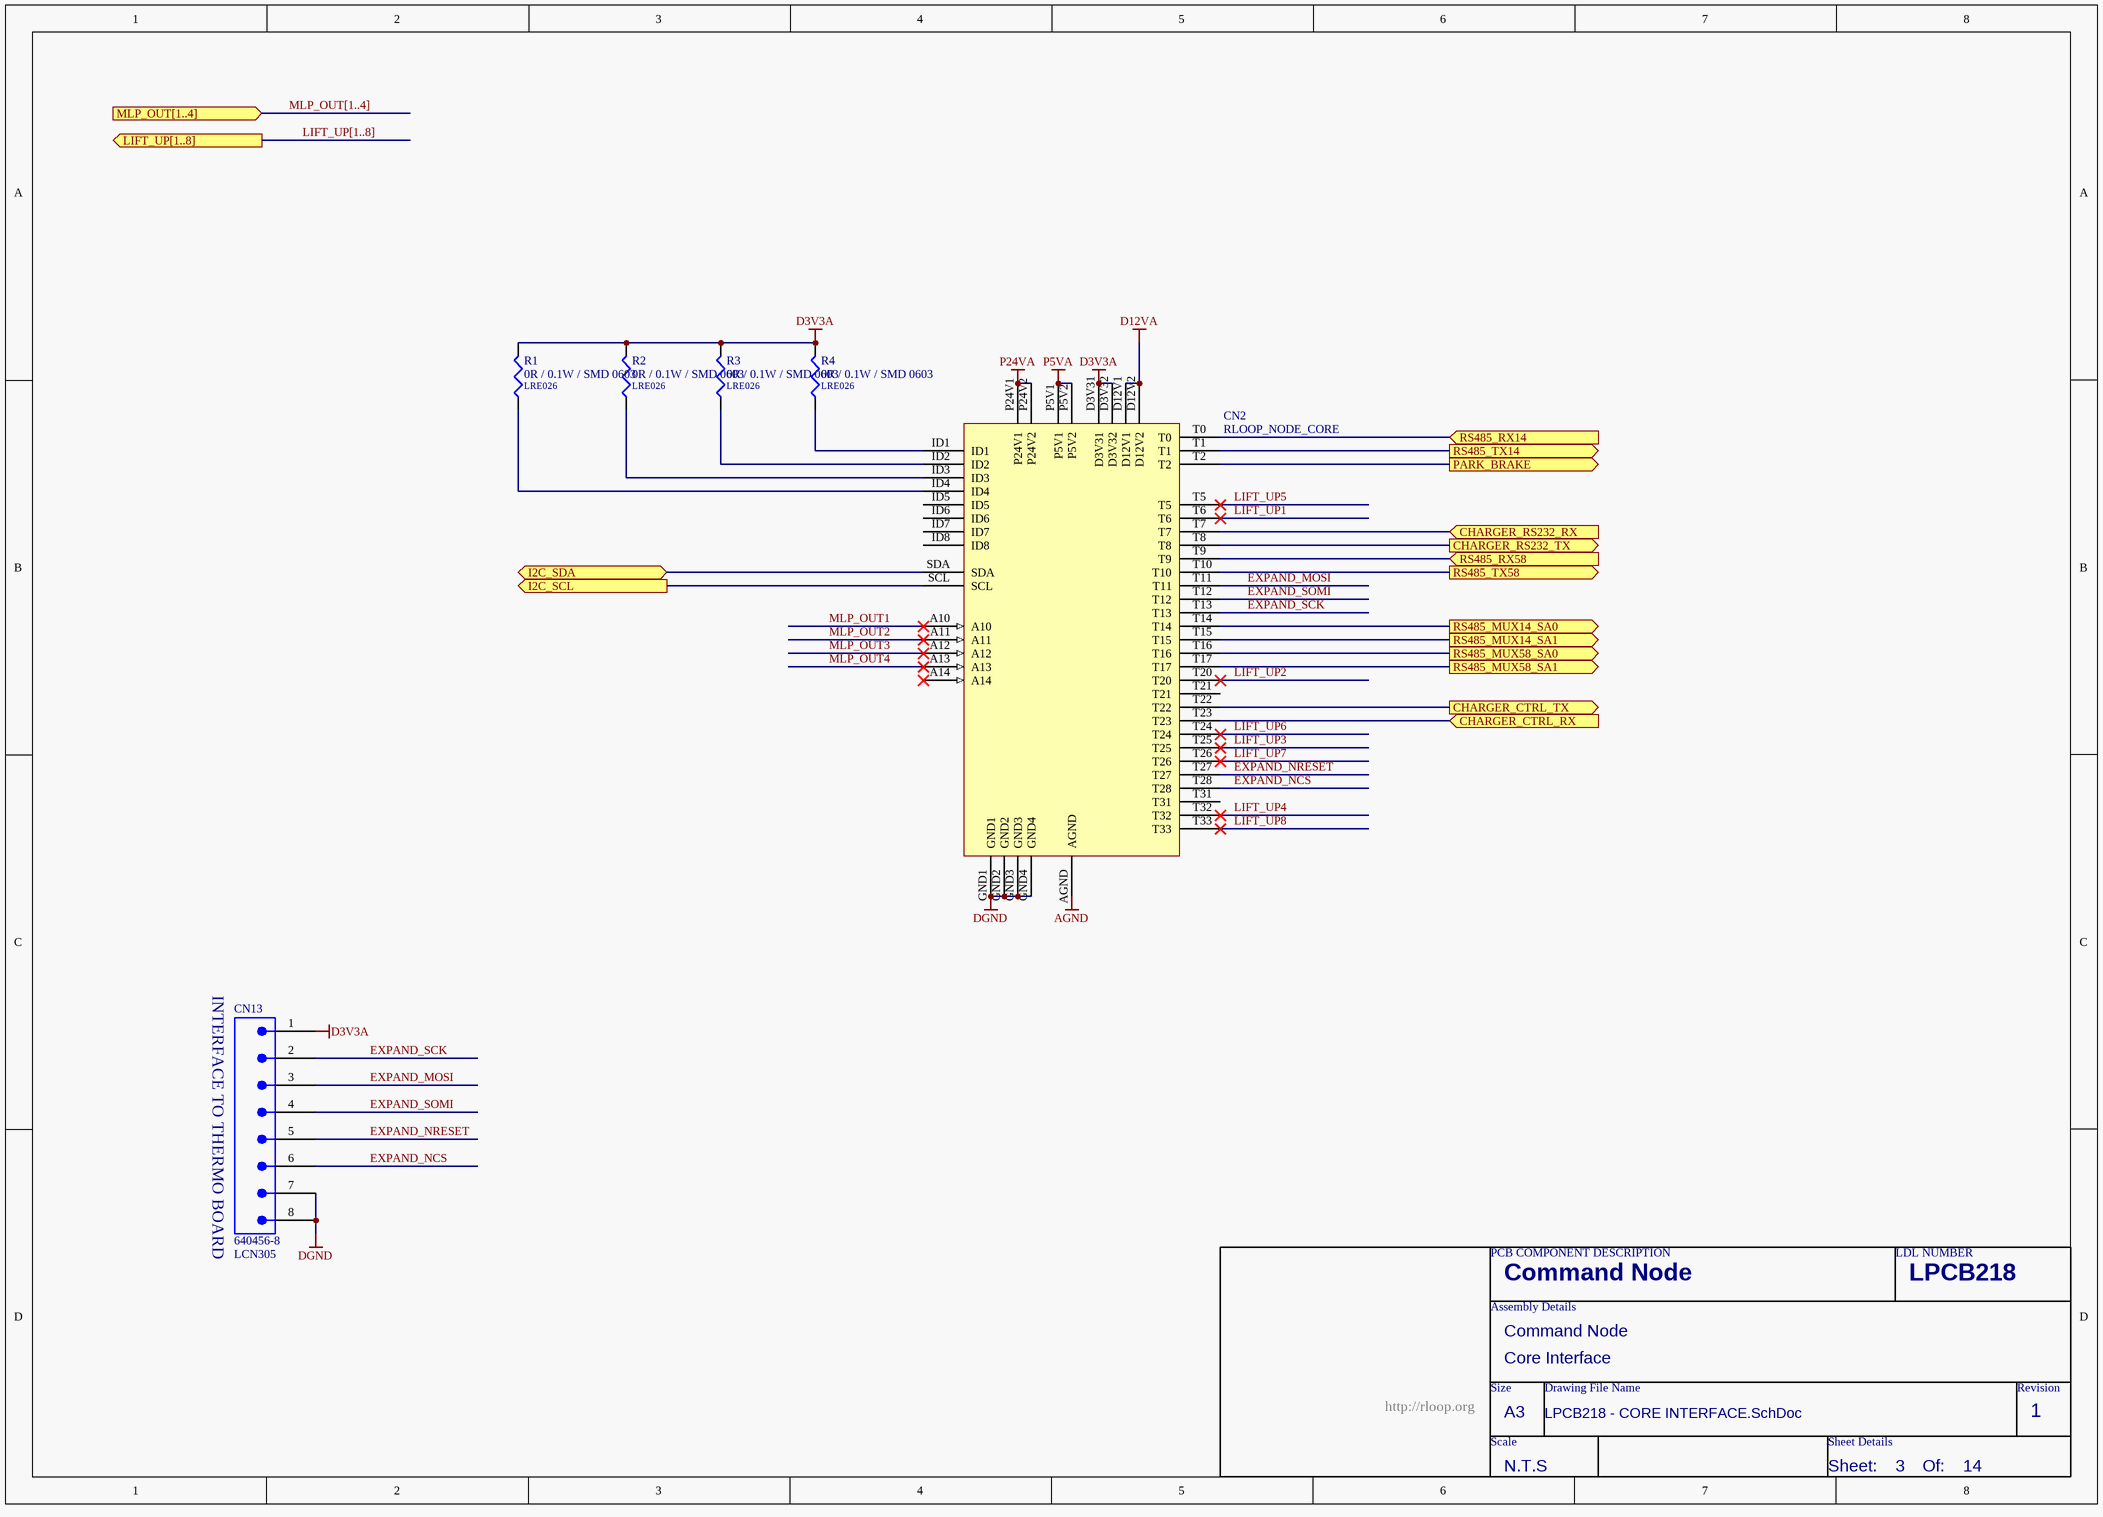
[diagram p11: LPCB218 - CORE INTERFACE.SchDoc]

### Parts
CN2  RLOOP_NODE_CORE  [RLOOP_NODE_CORE]  (no BOM)
CN13  640456-8  LDL_NUMBER: LCN305  [640456-8]
R1  0R / 0.1W / SMD 0603  LDL_NUMBER: LRE026  [LFP020__CR1608-0603-IPC7351_B]
R2  0R / 0.1W / SMD 0603  LDL_NUMBER: LRE026  [LFP020__CR1608-0603-IPC7351_B]
R3  0R / 0.1W / SMD 0603  LDL_NUMBER: LRE026  [LFP020__CR1608-0603-IPC7351_B]
R4  0R / 0.1W / SMD 0603  LDL_NUMBER: LRE026  [LFP020__CR1608-0603-IPC7351_B]

### Ports
CHARGER_CTRL_RX (in), CHARGER_CTRL_TX (out), CHARGER_RS232_RX (in), CHARGER_RS232_TX (out), I2C_SCL (out), I2C_SDA (bidir), LIFT_UP[1..8] (out), MLP_OUT[1..4] (in), PARK_BRAKE (out), RS485_MUX14_SA0 (out), RS485_MUX14_SA1 (out), RS485_MUX58_SA0 (out), RS485_MUX58_SA1 (out), RS485_RX14 (in), RS485_RX58 (in), RS485_TX14 (out), RS485_TX58 (out)

### Nets
AGND: CN2.AGND
D3V3A: CN2.D3V31 CN2.D3V32 CN13.1 R1.2 R2.2 R3.2 R4.2
D12VA: CN2.D12V1 CN2.D12V2
DGND: CN2.GND1 CN2.GND2 CN2.GND3 CN2.GND4 CN13.7 CN13.8
P5VA: CN2.P5V1 CN2.P5V2
P24VA: CN2.P24V1 CN2.P24V2
CHARGER_CTRL_RX: CN2.T23 ; port CHARGER_CTRL_RX
CHARGER_CTRL_TX: CN2.T22 ; port CHARGER_CTRL_TX
CHARGER_RS232_RX: CN2.T7 ; port CHARGER_RS232_RX
CHARGER_RS232_TX: CN2.T8 ; port CHARGER_RS232_TX
EXPAND_MOSI: CN2.T11 CN13.3
EXPAND_NCS: CN2.T28 CN13.6
EXPAND_NRESET: CN2.T27 CN13.5
EXPAND_SCK: CN2.T13 CN13.2
EXPAND_SOMI: CN2.T12 CN13.4
I2C_SCL: CN2.SCL ; port I2C_SCL
I2C_SDA: CN2.SDA ; port I2C_SDA
LIFT_UP1: CN2.T6
LIFT_UP2: CN2.T20
LIFT_UP3: CN2.T25
LIFT_UP4: CN2.T32
LIFT_UP5: CN2.T5
LIFT_UP6: CN2.T24
LIFT_UP7: CN2.T26
LIFT_UP8: CN2.T33
MLP_OUT1: CN2.A10
MLP_OUT2: CN2.A11
MLP_OUT3: CN2.A12
MLP_OUT4: CN2.A13
PARK_BRAKE: CN2.T2 ; port PARK_BRAKE
RS485_MUX14_SA0: CN2.T14 ; port RS485_MUX14_SA0
RS485_MUX14_SA1: CN2.T15 ; port RS485_MUX14_SA1
RS485_MUX58_SA0: CN2.T16 ; port RS485_MUX58_SA0
RS485_MUX58_SA1: CN2.T17 ; port RS485_MUX58_SA1
RS485_RX14: CN2.T0 ; port RS485_RX14
RS485_RX58: CN2.T9 ; port RS485_RX58
RS485_TX14: CN2.T1 ; port RS485_TX14
RS485_TX58: CN2.T10 ; port RS485_TX58
NetCN2_ID1: CN2.ID1 R4.1
NetCN2_ID2: CN2.ID2 R3.1
NetCN2_ID3: CN2.ID3 R2.1
NetCN2_ID4: CN2.ID4 R1.1

Not connected (* = marked no-connect by the designer): CN2 A14* ID5 ID6 ID7 ID8 T21 T31

### Buses and harness runs
bus LIFT_UP[1..8] = port LIFT_UP[1..8]
bus MLP_OUT[1..4] = port MLP_OUT[1..4]

### Notes on the sheet
- (near CN13) INTERFACE TO THERMO BOARD
- PCB COMPONENT DESCRIPTION
- LDL NUMBER
- Assembly Details
- Size
- Drawing File Name
- Revision
- http://rloop.org
- Scale
- A3
- Sheet Details
- N.T.S
- Sheet:
- Of:

### Library data of the parts
CN2 = RLOOP_NODE_CORE: rLoop Node Core Connector; FMEDA__CHANNEL: COM; FMEDA__OPERATING__CURRENT_MAX: 0; FMEDA__OPERATING__TEMP_MAX: 50; FMEDA__OPERATING__TEMP_MIN: -20; FMEDA__OPERATING__TEMP_TYP: 27; FMEDA__OPERATING__VOLTAGE_MAX: 16; FMEDA__OPERATING__VOLTAGE_TYP: 12; FMEDA__OPERATING__CURRENT_MIN: 0; FMEDA__OPERATING__CURRENT_TYP: 0; FMEDA__OPERATING__VOLTAGE_MIN: 0
CN13 = 640456-8: as CN1 on sheet LPCB218 - CHARGER INTERFACE; FMEDA__FUNCTION_IN_SYSTEM: *; FMEDA__OPERATING__CURRENT_MIN: 0; FMEDA__OPERATING__CURRENT_TYP: 0; FMEDA__OPERATING__VOLTAGE_MIN: 0
R1-R4 = 0R / 0.1W / SMD 0603: Resistor, Ceramic Chip, 0R, 0.1W, SMD 0603 [LRE026]; Value: 0; FMEDA__OPERATING__TEMP_MAX: 50; FMEDA__OPERATING__TEMP_MIN: -20; FMEDA__OPERATING__TEMP_TYP: 27; FMEDA__CHANNEL: COM; FMEDA__OPERATING__POWER_MAX: 0; FMEDA__OPERATING__POWER_MIN: 0; FMEDA__OPERATING__VOLTAGE_MAX: 0; FMEDA__OPERATING__VOLTAGE_MIN: 0; FMEDA__OPERATING__VOLTAGE_TYP: 0; FMEDA__FUNCTION_IN_SYSTEM: *

## Sheet LPCB218 - INTERNAL PRESSURE.SchDoc
size A3; Address1: Factory 10; Address2: 9-13 Dingley Avenue, Dandeong, VICTORIA 3175, AUSTRALIA; DocumentNumber: 9; Revision: 1; SheetNumber: 9; SheetTotal: 14; Lockie__PCB_SUB_ASSEMBLY: Internal Pressure; Lockie__PCB_ASSEMBLY: Command Node; Lockie__LDL: LPCB218; Lockie__PCB_DESCRIPTION: Command Node
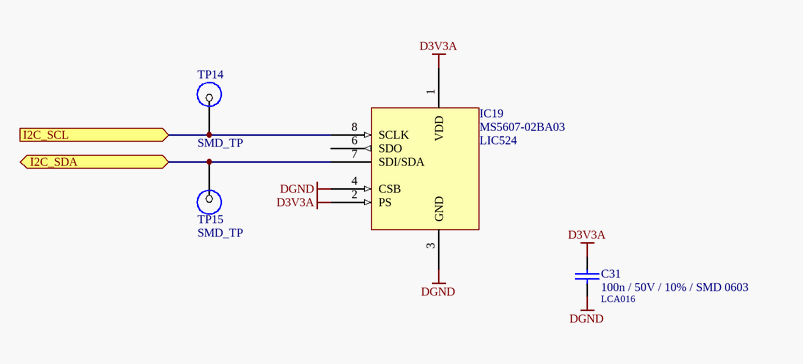
[diagram p12: LPCB218 - INTERNAL PRESSURE.SchDoc]

### Parts
C31  100n / 50V / 10% / SMD 0603  LDL_NUMBER: LCA016  [LFP011__CC1608-0603-IPC7351_B]
IC19  MS5607-02BA03  LDL_NUMBER: LIC524  [LFP140__QFN8]
TP14  SMD_TP  [SMD-TP]  (no BOM)
TP15  SMD_TP  [SMD-TP]  (no BOM)

### Ports
I2C_SCL (in), I2C_SDA (bidir)

### Nets
D3V3A: C31.1 IC19.1(VDD) IC19.2(PS)
DGND: C31.2 IC19.3(GND) IC19.4(CSB)
I2C_SCL: IC19.8(SCLK) TP14.1 ; port I2C_SCL
I2C_SDA: IC19.7(SDI/SDA) TP15.1 ; port I2C_SDA

Not connected (* = marked no-connect by the designer): IC19 6(SDO)

### Notes on the sheet
- PCB COMPONENT DESCRIPTION
- LDL NUMBER
- Assembly Details
- Size
- Drawing File Name
- Revision
- http://rloop.org
- Scale
- A3
- Sheet Details
- N.T.S
- Sheet:
- Of:

### Library data of the parts
C31 = 100n / 50V / 10% / SMD 0603: as C24 on sheet LPCB218 - RS485 MUX CONTROL; Value: 100n; FMEDA__FUNCTION_IN_SYSTEM: *; FMEDA__OPERATING__VOLTAGE_TYP: 3.3
IC19 = MS5607-02BA03: IC, Pressure Sensor IC, SMD QFN8 [LIC524]
TP14 TP15 = SMD_TP: as TP1 on sheet LPCB218 - RS485 MUX CONTROL; FMEDA__OPERATING__CURRENT_MIN: 0; FMEDA__OPERATING__CURRENT_TYP: 0; FMEDA__OPERATING__VOLTAGE_MIN: 0

## Sheet LPCB218 - EXTERNAL I2C.SchDoc
size A3; Address1: Factory 10; Address2: 9-13 Dingley Avenue, Dandeong, VICTORIA 3175, AUSTRALIA; DocumentNumber: 4; Revision: 1; SheetNumber: 4; SheetTotal: 14; Lockie__PCB_SUB_ASSEMBLY: External I2C; Lockie__PCB_ASSEMBLY: Command Node; Lockie__LDL: LPCB218; Lockie__PCB_DESCRIPTION: Command Node
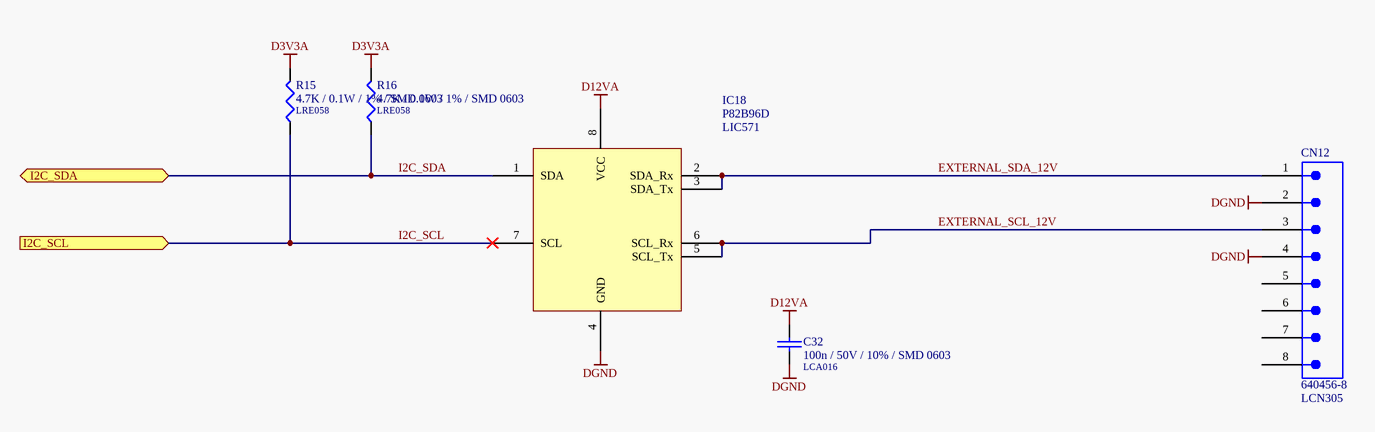
[diagram p13: LPCB218 - EXTERNAL I2C.SchDoc]

### Parts
C32  100n / 50V / 10% / SMD 0603  LDL_NUMBER: LCA016  [LFP011__CC1608-0603-IPC7351_B]
CN12  640456-8  LDL_NUMBER: LCN305  [640456-8]
IC18  P82B96D  LDL_NUMBER: LIC571  [LFP097__SOIC150-8]
R15  4.7K / 0.1W / 1% / SMD 0603  LDL_NUMBER: LRE058  [LFP020__CR1608-0603-IPC7351_B]
R16  4.7K / 0.1W / 1% / SMD 0603  LDL_NUMBER: LRE058  [LFP020__CR1608-0603-IPC7351_B]

### Ports
I2C_SCL (in), I2C_SDA (bidir)

### Nets
D3V3A: R15.2 R16.2
D12VA: C32.1 IC18.8(VCC)
DGND: C32.2 CN12.2 CN12.4 IC18.4(GND)
EXTERNAL_SCL_12V: CN12.3 IC18.5(SCL_Tx) IC18.6(SCL_Rx)
EXTERNAL_SDA_12V: CN12.1 IC18.2(SDA_Rx) IC18.3(SDA_Tx)
I2C_SCL: IC18.7(SCL) R15.1 ; port I2C_SCL
I2C_SDA: IC18.1(SDA) R16.1 ; port I2C_SDA

Not connected (* = marked no-connect by the designer): CN12 5 6 7 8

### Notes on the sheet
- PCB COMPONENT DESCRIPTION
- LDL NUMBER
- Assembly Details
- Size
- Drawing File Name
- Revision
- http://rloop.org
- Scale
- A3
- Sheet Details
- N.T.S
- Sheet:
- Of:

### Library data of the parts
C32 = 100n / 50V / 10% / SMD 0603: as C24 on sheet LPCB218 - RS485 MUX CONTROL; Value: 100n; FMEDA__FUNCTION_IN_SYSTEM: *; FMEDA__OPERATING__VOLTAGE_TYP: 3.3
CN12 = 640456-8: as CN1 on sheet LPCB218 - CHARGER INTERFACE; FMEDA__FUNCTION_IN_SYSTEM: *; FMEDA__OPERATING__CURRENT_MIN: 0; FMEDA__OPERATING__CURRENT_TYP: 0; FMEDA__OPERATING__VOLTAGE_MIN: 0
IC18 = P82B96D: IC, I2C Line Driver [LIC571]
R15 R16 = 4.7K / 0.1W / 1% / SMD 0603: Resistor, Ceramic Chip, 4K7, 0.1W, 1%, SMD 0603 [LRE058]; FMEDA__OPERATING__POWER_MAX: 0; FMEDA__OPERATING__TEMP_MAX: 50; FMEDA__OPERATING__TEMP_MIN: -20; FMEDA__OPERATING__TEMP_TYP: 27; FMEDA__CHANNEL: COM; VALUE: 4.7K; FMEDA__OPERATING__POWER_MIN: 0; FMEDA__OPERATING__VOLTAGE_MAX: 0; FMEDA__OPERATING__VOLTAGE_MIN: 0; FMEDA__OPERATING__VOLTAGE_TYP: 0; FMEDA__FUNCTION_IN_SYSTEM: *